# EasyEDA Pro project Car.eprj, board PCB1
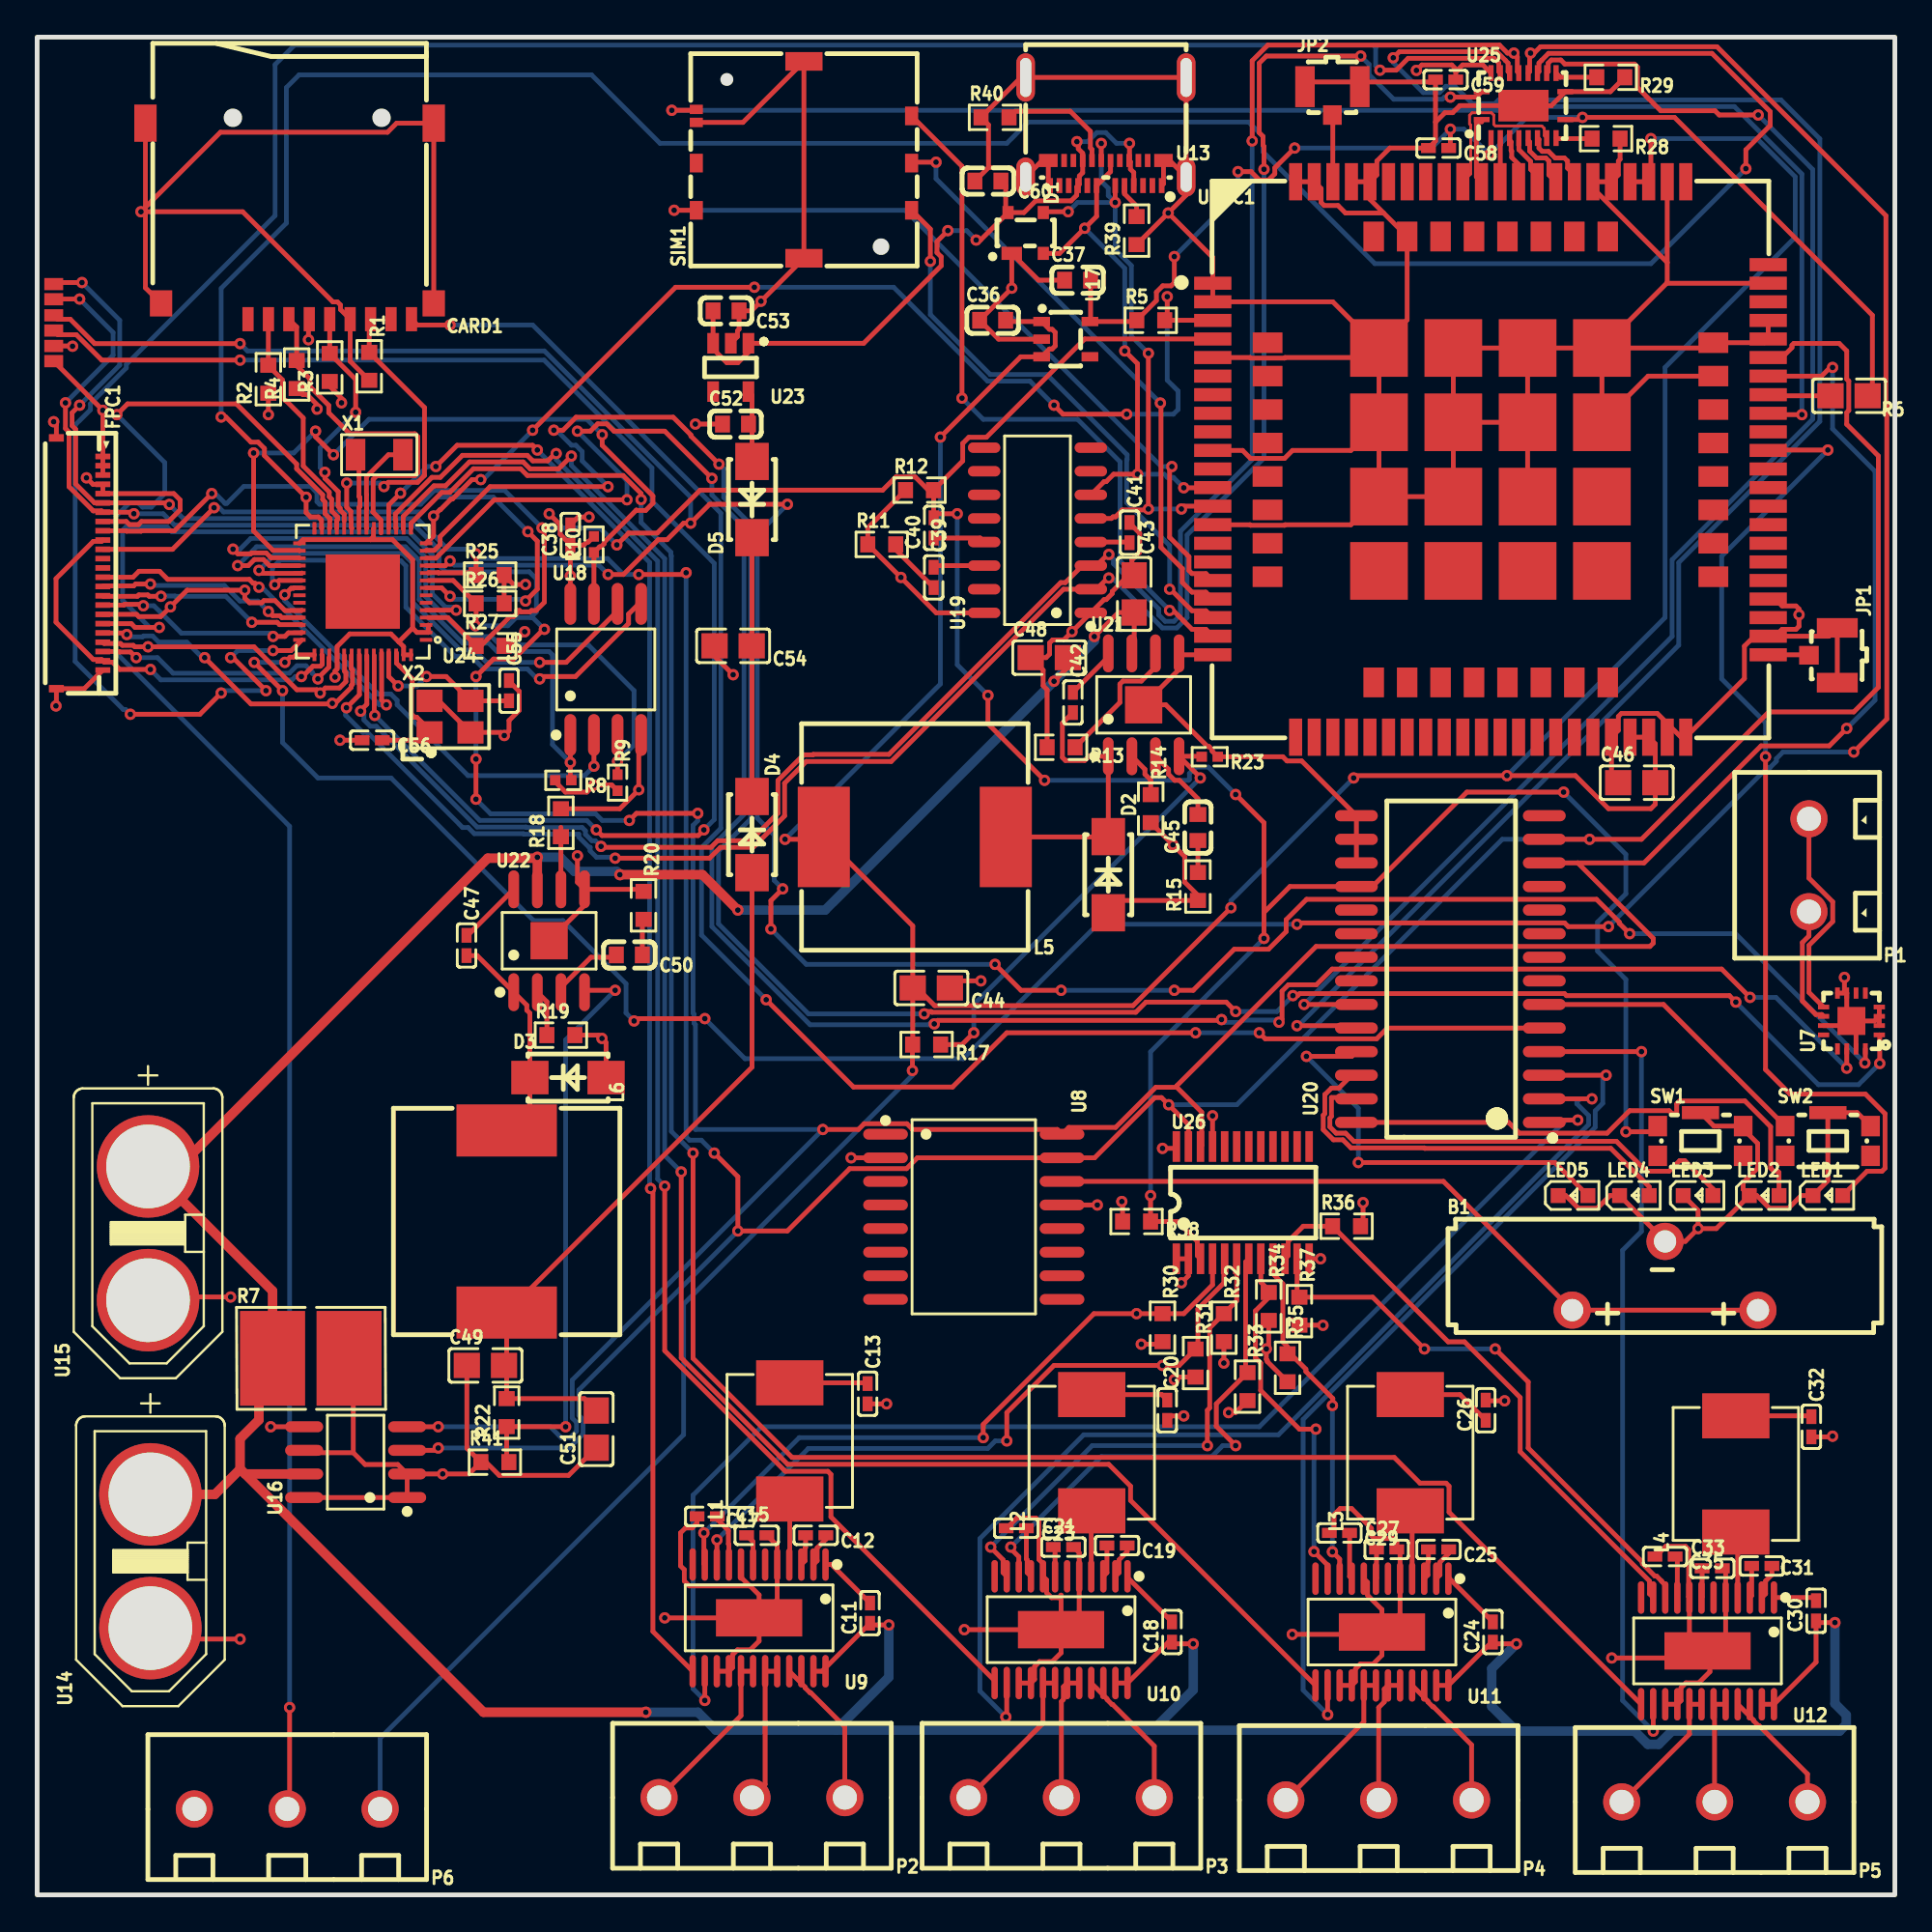
[diagram p2: board, top side]
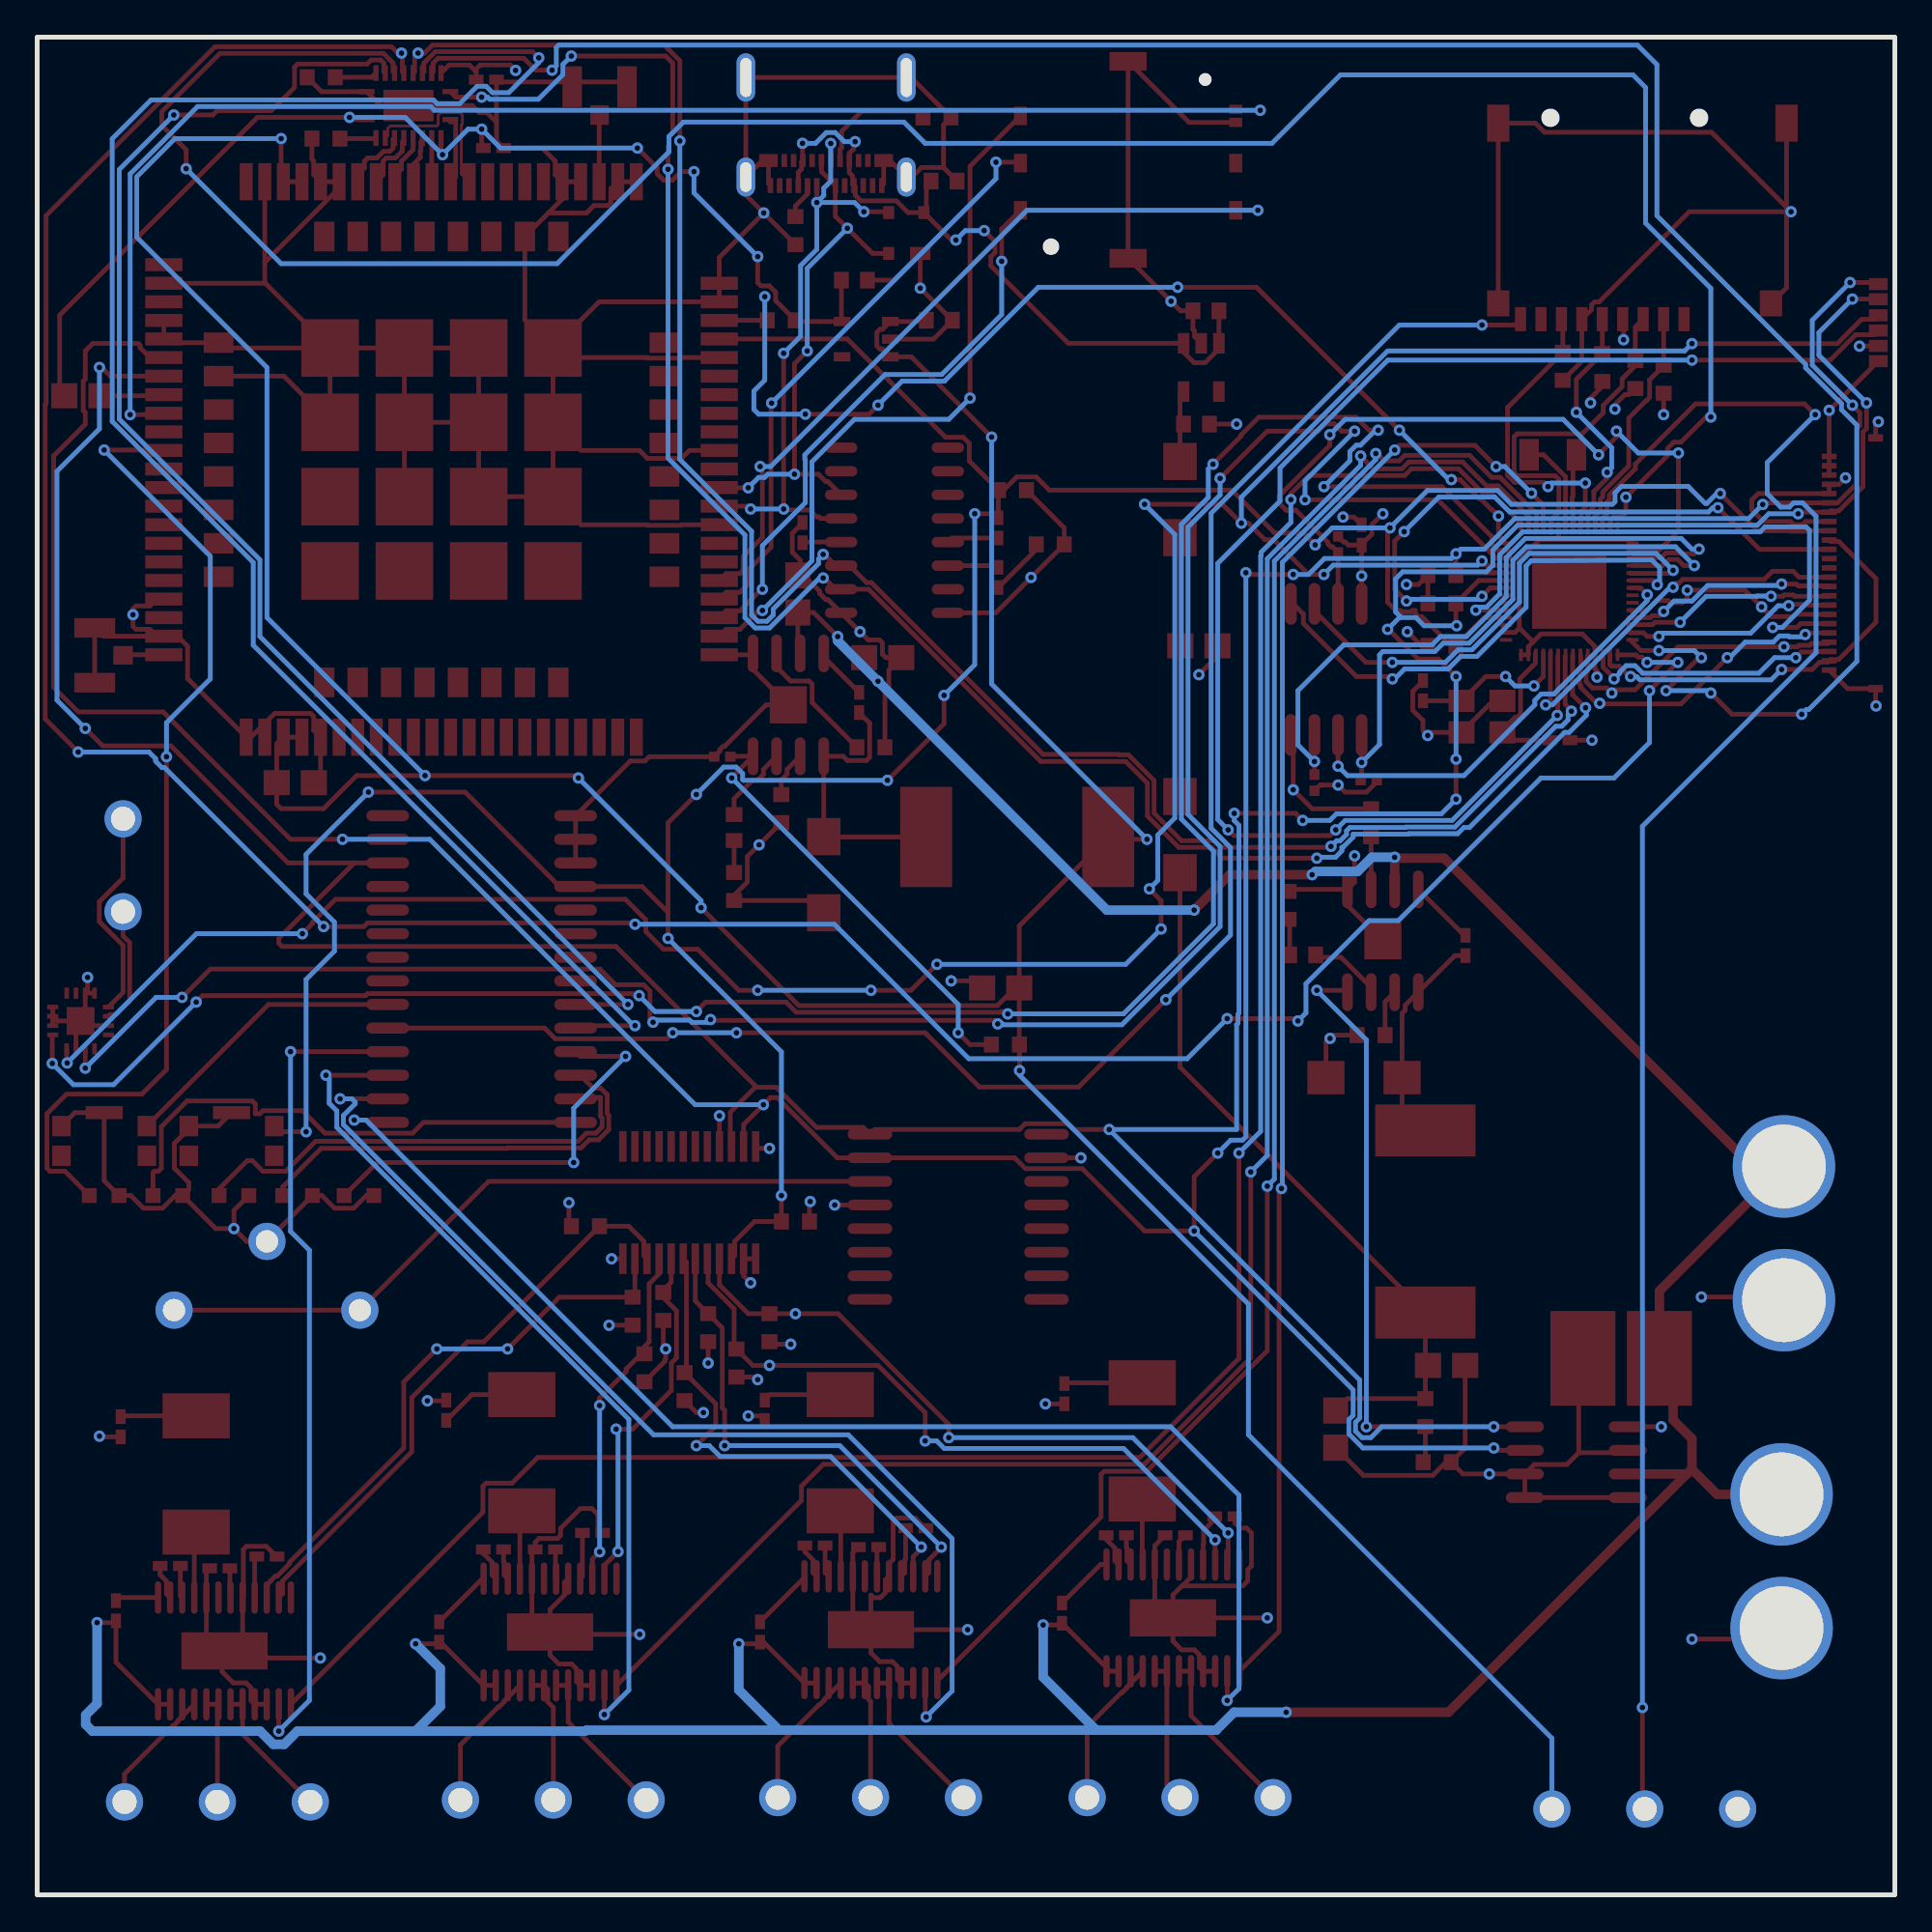
[diagram p3: board, bottom side, seen from below]

Outline 100 x 100 mm; copper layers: Top Layer, Inner1, Inner2, Bottom Layer. Coordinates in mm from the lower left corner of the outline.
Outline path: rectangle 0,100 100,0
Stack: Top Layer 0.035mm Outer layer thickness 1oz / Dielectric1 0.2104mm 7628 RC49% 8.6mil / Inner1 0.0152mm Inner layer thickness / Dielectric2 1.065mm 1.1mm H/HOZ Copper / Inner2 0.0152mm Inner layer thickness / Dielectric3 0.2104mm 7628 RC49% 8.6mil / Bottom Layer 0.035mm Outer layer thickness 1oz

## Design rules (mm)
template: Custom Config
spacing copperThickness1oz (default): track to track 0.102, other pairs 0.152 to 0.3
spacing copperThickness2oz: track to track 0.203, other pairs 0.152 to 0.3
track width copperThickness1oz (default): min 0.127, default 0.254, max 2.54
track width copperThickness2oz: min 0.203, default 0.254, max 2.54
differential pair differentialPair (default): width min 0.127, default 0.254, max 2.54; gap min 0.152, default 0.152
via viaSize (default): diameter min 0.5, default 0.61, max 10; hole min 0.3, default 0.305, max 6.3

## Placement (name value [footprint] x y rotation side)
B1  CR2032-BS-5-1  [BAT-TH_CR2032-BS-5-1]  87.63 33.33 0 top
C11  100nF  [C0402]  44.83 15.16 90 top
C12  100nF  [C0402]  41.91 19.35 180 top
C13  100nF  [C0402]  44.7 26.97 270 top
C15  100nF  [C0402]  38.74 19.35 0 top
C17  100nF  [C0402]  36.07 20.37 180 top
C18  100nF  [C0402]  61.09 14.15 90 top
C19  100nF  [C0402]  58.13 18.8 180 top
C20  100nF  [C0402]  60.83 26.09 270 top
C21  100nF  [C0402]  55.25 18.72 0 top
C23  100nF  [C0402]  52.71 19.74 180 top
C24  100nF  [C0402]  78.36 14.15 90 top
C25  100nF  [C0402]  75.44 18.59 180 top
C26  100nF  [C0402]  77.98 26.09 90 top
C27  100nF  [C0402]  72.64 18.59 0 top
C29  100nF  [C0402]  70.1 19.48 180 top
C30  100nF  [C0402]  95.76 15.29 90 top
C31  100nF  [C0402]  92.84 17.7 180 top
C32  100nF  [C0402]  95.5 25.2 270 top
C33  100nF  [C0402]  90.17 17.58 0 top
C35  100nF  [C0402]  87.63 18.21 180 top
C36  1uF  [C0603]  51.44 84.76 0 top
C37  1uF  [C0603]  56.01 86.92 0 top
C38  100nF  [C0402]  28.7 73.2 90 top
C39  100nF  [C0402]  48.26 70.92 270 top
C40  100nF  [C0402]  48.26 73.58 90 top
C41  4.7uF  [C0402]  58.8 73.33 270 top
C42  100nF  [C0402]  55.75 64.19 270 top
C43  10uF  [C0805]  59.06 70.03 270 top
C44  22uF  [C0805]  48.13 48.82 180 top
C45  220pF  [C0603]  62.48 57.45 90 top
C46  22uF  [C0805]  86.11 59.87 0 top
C47  100nF  [C0402]  23.11 51.11 270 top
C48  10uF  [C0805]  54.48 66.6 0 top
C49  22uF  [C0805]  24.13 28.5 0 top
C50  220pF  [C0603]  31.88 50.6 180 top
C51  22uF  [C0805]  30.1 25.07 90 top
C52  1uF  [C0603]  37.59 79.17 0 top
C53  1uF  [C0603]  37.08 85.27 180 top
C54  22uF  [C0805]  37.47 67.23 180 top
C55  20pF  [C0402]  25.4 64.82 270 top
C56  20pF  [C0402]  18.03 62.15 180 top
C58  100nF  [C0402]  75.44 94.03 180 top
C59  100nF  [C0402]  75.82 97.71 180 top
C60  1uF  [C0603]  51.18 92.25 180 top
CARD1  TF-01A  [TF-SMD_TF-01A]  13.59 90.09 180 top
D1  TPD2E001DZDR  [SOT-143_L2.9-W1.3-P1.92-LS2.3-BR]  53.21 89.46 270 top
D2  SS32  [SMAF_L4.3-W2.5-LS5.0-RD]  57.66 54.92 270 top
D3  SS32  [SMAF_L4.3-W2.5-LS5.0-RD]  28.57 43.99 0 top
D4  SS32  [SMAF_L4.3-W2.5-LS5.0-RD]  38.48 57.07 270 top
D5  SS32  [SMAF_L4.3-W2.5-LS5.0-RD]  38.48 75.11 90 top
FPC1  FFC2B28-24-G  [FPC-SMD_24P-P0.50_XKB_X05A10L24G]  2.29 71.68 270 top
JP1  U.FL-R-SMT-1(80)  [RF-SMD_FRF05002-JSS103M]  96.14 66.73 270 top
JP2  U.FL-R-SMT-1(80)  [RF-SMD_FRF05002-JSS103M]  69.72 96.57 0 top
L1  47uH  [IND-SMD_L7.0-W6.6_FXL0630]  40.51 24.44 90 top
L2  47uH  [IND-SMD_L7.0-W6.6_FXL0630]  56.77 23.8 90 top
L3  47uH  [IND-SMD_L7.0-W6.6_FXL0630]  73.91 23.8 90 top
L4  47uH  [IND-SMD_L7.0-W6.6_FXL0630]  91.44 22.66 90 top
L5  10uH  [IND-SMD_L12.0-W12.0]  47.24 56.95 180 top
L6  10uH  [IND-SMD_L12.0-W12.0]  25.27 36.25 270 top
LED1  KT-0603R  [LED0603-RD]  96.39 37.64 0 top
LED2  KT-0603R  [LED0603-RD]  92.96 37.64 0 top
LED3  KT-0603R  [LED0603-RD]  89.41 37.64 0 top
LED4  KT-0603R  [LED0603-RD]  85.98 37.64 0 top
LED5  KT-0603R  [LED0603-RD]  82.68 37.64 0 top
NOREF  -  [Pad_e325]  0.89 86.71 0 top
NOREF#2  -  [Pad_e336]  0.89 82.56 0 top
NOREF#3  -  [Pad_e333]  0.89 85.03 0 top
NOREF#4  -  [Pad_e334]  0.89 84.21 0 top
NOREF#5  -  [Pad_e327]  0.89 85.89 0 top
NOREF#6  -  [Pad_e335]  0.89 83.38 0 top
P1  WJ126V-5.0-2P  [CONN-TH_WJ126V-5.0-2P]  95.38 55.42 180 top
P2  WJ126V-5.0-3P  [CONN-TH_3P-P5.00_WJ126V-5.0-3P]  38.48 5.23 180 top
P3  WJ126V-5.0-3P  [CONN-TH_3P-P5.00_WJ126V-5.0-3P]  55.14 5.23 180 top
P4  WJ126V-5.0-3P  [CONN-TH_3P-P5.00_WJ126V-5.0-3P]  72.22 5.11 180 top
P5  WJ126V-5.0-3P  [CONN-TH_3P-P5.00_WJ126V-5.0-3P]  90.3 5 180 top
P6  WJ126V-5.0-3P  [CONN-TH_3P-P5.00_WJ126V-5.0-3P]  13.46 4.62 180 top
R1  10kΩ  [R0603]  17.87 82.28 270 top
R2  10kΩ  [R0603]  12.45 81.58 90 top
R3  10kΩ  [R0603]  15.75 82.22 90 top
R4  10kΩ  [R0603]  13.97 81.84 90 top
R5  1kΩ  [R0603]  59.94 84.76 0 top
R6  3.7kΩ  [C0805]  97.54 80.7 180 top
R7  5mΩ  [R2818]  14.73 28.88 0 top
R8  100kΩ  [R0402]  28.32 60 180 top
R9  100kΩ  [R0402]  31.24 59.87 270 top
R10  100kΩ  [R0402]  29.97 72.69 90 top
R11  10kΩ  [R0603]  45.47 72.69 0 top
R12  10kΩ  [R0603]  47.5 75.62 0 top
R13  180kΩ  [R0603]  55.12 61.77 180 top
R14  1kΩ  [R0603]  59.94 58.47 270 top
R15  68.1kΩ  [R0603]  62.48 54.28 90 top
R17  127kΩ  [R0603]  47.88 45.77 180 top
R18  180kΩ  [R0603]  28.19 57.71 90 top
R19  1kΩ  [R0603]  28.19 46.28 0 top
R20  68.1kΩ  [R0603]  32.64 53.26 270 top
R22  127kΩ  [R0603]  25.27 25.96 90 top
R23  31.6kΩ  [R0402]  63.12 61.27 180 top
R25  10kΩ  [R0603]  24.38 71.04 0 top
R26  10kΩ  [R0603]  24.38 69.52 0 top
R27  10kΩ  [R0603]  24.38 67.23 0 top
R28  47kΩ  [R0603]  84.46 94.54 180 top
R29  47kΩ  [R0603]  84.71 97.84 180 top
R30  10kΩ  [R0603]  60.58 30.53 270 top
R31  10kΩ  [R0603]  62.36 28.63 270 top
R32  10kΩ  [R0603]  63.88 30.53 270 top
R33  10kΩ  [R0603]  65.15 27.36 270 top
R34  10kΩ  [R0603]  66.29 31.67 270 top
R35  10kΩ  [R0603]  67.31 28.37 270 top
R36  10kΩ  [R0603]  70.49 35.99 0 top
R37  10kΩ  [R0603]  67.94 31.42 270 top
R38  10kΩ  [R0603]  59.18 36.25 180 top
R39  5.1kΩ  [R0603]  59.18 89.59 90 top
R40  5.1kΩ  [R0603]  51.56 95.68 0 top
R41  40.2kΩ  [R0603]  24.64 23.29 0 top
SIM1  SIM8055-6-1-14-01-A  [SIM-SMD_SIM8055-6-1-14-01-A]  41.28 93.4 90 top
SW1  KMR221GLFS  [KEY-SMD_KMR2XXGXXX]  89.53 40.94 0 top
SW2  KMR221GLFS  [KEY-SMD_KMR2XXGXXX]  96.39 40.94 0 top
U7  MAX98357AETE+T  [TQFN-16_L3.0-W3.0-P0.50-BL-EP1.5]  97.66 47.04 90 top
U8  DS3231SN#T&R  [SOIC-16_L10.3-W7.5-P1.27-LS10.3-BL]  50.42 36.5 270 top
U9  DRV10983PWPR  [HTSSOP-24_L7.8-W4.4-P0.65-LS6.4-BL-EP-1]  38.86 14.91 180 top
U10  DRV10983PWPR  [HTSSOP-24_L7.8-W4.4-P0.65-LS6.4-BL-EP-1]  55.12 14.28 180 top
U11  DRV10983PWPR  [HTSSOP-24_L7.8-W4.4-P0.65-LS6.4-BL-EP-1]  72.39 14.15 180 top
U12  DRV10983PWPR  [HTSSOP-24_L7.8-W4.4-P0.65-LS6.4-BL-EP-1]  89.92 13.13 180 top
U13  SIM7600G  [COMM-SMD_135P-L30.0-W30.0_SIM7600G]  78.23 77.27 0 top
U14  XT60-F  [CONN-TH_XT60PB-F]  6.1 17.96 90 top
U15  XT60-F  [CONN-TH_XT60PB-F]  5.97 35.61 90 top
U16  INA219AID  [SOIC-8_L4.9-W3.9-P1.27-LS6.0-BL]  17.14 23.29 90 top
U17  AP2112K-1.8TRG1  [SOT-25_L3.0-W1.6-P0.95-LS2.8-BL]  55.37 83.74 270 top
U18  W25Q128JVSIQ  [SOIC-8_L5.3-W5.3-P1.27-LS8.0-BL]  30.61 65.96 0 top
U19  CH340C  [SOP-16_L10.0-W3.9-P1.27-LS6.0-BL]  53.85 73.46 90 top
U20  MCP23017-E/SO  [SOIC-28_L18.0-W7.5-P1.27-LS10.3-BL]  76.07 49.83 90 top
U21  MP1584EN-LF-Z  [SOIC-8_L5.0-W4.0-P1.27-LS6.0-BL-EP2.0]  59.56 64.06 0 top
U22  MP1584EN-LF-Z  [SOIC-8_L5.0-W4.0-P1.27-LS6.0-BL-EP2.0]  27.56 51.36 0 top
U23  AP2112K-3.3TRG1  [SOT-25-5_L2.9-W1.6-P0.95-LS2.8-BL]  37.34 82.22 180 top
U24  ESP32-S3  [QFN-56_L7.0-W7.0-P0.40-TL-EP4.0]  17.53 70.16 180 top
U25  TXB0108RGYR  [VQFN-20_L4.5-W3.5-P0.50-BL-EP]  80.01 96.32 0 top
U26  TCA9548APWR  [TSSOP-24_L7.8-W4.4-P0.65-LS6.4-BL]  64.9 37.26 0 top
USBC1  1054500101  [USB-C-SMD_TYPE-C-USB-18]  57.53 94.92 180 top
X1  32.768kHz  [OSC-SMD_L3.2-W1.5]  18.42 77.52 0 top
X2  40MHz  [OSC-SMD_4P-L3.2-W2.5-BL_SIT8008BI]  22.22 63.42 0 top

## Footprints (pads in the part's own frame, mm; a bottom-side part is the same pattern mirrored in y, then rotated)
BAT-TH_CR2032-BS-5-1
  round 2 hole 1.2: 1(-5,-1.85) 1(5,-1.85) 2(0,1.85)
C0402
  rect 0.79x0.54 smd: 1(-0.545,0) 2(0.545,0)
C0603
  rect 0.8x0.9 smd: 1(-0.7,0) 2(0.7,0)
C0805
  rect 1.41x1.35 smd: 1(-1,0) 2(1,0)
COMM-SMD_135P-L30.0-W30.0_SIM7600G
  rect 2x0.7 smd: 1(-14.95,9.486) 2(-14.95,8.486) 3(-14.95,7.486) 4(-14.95,6.486) 5(-14.95,5.486) 6(-14.95,4.486) 7(-14.95,3.486) 8(-14.95,2.486) 9(-14.95,1.486) 10(-14.95,0.486) 11(-14.95,-0.514) 12(-14.95,-1.514) 13(-14.95,-2.514) 14(-14.95,-3.514) 15(-14.95,-4.514) 16(-14.95,-5.514) 17(-14.95,-6.514) 18(-14.95,-7.514) 19(-14.95,-8.514) 20(-14.95,-9.514) 41(14.95,-9.514) 42(14.95,-8.514) 43(14.95,-7.514) 44(14.95,-6.514) 45(14.95,-5.514) 46(14.95,-4.514) 47(14.95,-3.514) 48(14.95,-2.514) 49(14.95,-1.514) 50(14.95,-0.514) 51(14.95,0.486) 52(14.95,1.486) 53(14.95,2.486) 54(14.95,3.486) 55(14.95,4.486) 56(14.95,5.486) 57(14.95,6.486) 58(14.95,7.486) 59(14.95,8.486) 60(14.95,9.486) 81(-14.95,-10.514) 82(14.95,-10.514) 85(14.95,10.486)
  rect 0.7x2 smd: 21(-9.486,-14.95) 22(-8.486,-14.95) 23(-7.486,-14.95) 24(-6.486,-14.95) 25(-5.486,-14.95) 26(-4.486,-14.95) 27(-3.486,-14.95) 28(-2.486,-14.95) 29(-1.486,-14.95) 30(-0.486,-14.95) 31(0.514,-14.95) 32(1.514,-14.95) 33(2.514,-14.95) 34(3.514,-14.95) 35(4.514,-14.95) 36(5.514,-14.95) 37(6.514,-14.95) 38(7.514,-14.95) 39(8.514,-14.95) 40(9.514,-14.95) 61(9.514,14.95) 62(8.514,14.95) 63(7.514,14.95) 64(6.514,14.95) 65(5.514,14.95) 66(4.514,14.95) 67(3.514,14.95) 68(2.514,14.95) 69(1.514,14.95) 70(0.514,14.95) 71(-0.486,14.95) 72(-1.486,14.95) 73(-2.486,14.95) 74(-3.486,14.95) 75(-4.486,14.95) 76(-5.486,14.95) 77(-6.486,14.95) 78(-7.486,14.95) 79(-8.486,14.95) 80(-9.486,14.95) 83(10.514,-14.95) 84(-10.486,-14.95) 86(-10.486,14.95) 87(10.514,14.95)
  rect 1.6x1.1 smd: 88(-12,6.286) 89(-12,4.486) 90(-12,2.686) 91(-12,0.886) 92(-12,-0.914) 93(-12,-2.714) 94(-12,-4.514) 95(-12,-6.314) 104(12,-6.314) 105(12,-4.514) 106(12,-2.714) 107(12,-0.914) 108(12,0.886) 109(12,2.686) 110(12,4.486) 111(12,6.286)
  rect 1.1x1.6 smd: 96(-6.286,-12) 97(-4.486,-12) 98(-2.686,-12) 99(-0.886,-12) 100(0.914,-12) 101(2.714,-12) 102(4.514,-12) 103(6.314,-12) 112(6.314,12) 113(4.514,12) 114(2.714,12) 115(0.914,12) 116(-0.886,12) 117(-2.686,12) 118(-4.486,12) 119(-6.286,12)
  rect 3.1x3.1 smd: 120(-6,6) 121(-6,2) 122(-6,-2) 123(-6,-6) 124(-2,-6) 125(2,-6) 126(6,-6) 127(6,-2) 128(6,2) 129(6,6) 130(2,6) 131(-2,6) 132(-2,2) 133(-2,-2) 134(2,-2) 135(2,2)
CONN-TH_3P-P5.00_WJ126V-5.0-3P
  round 2 hole 1.3: 1(5,0) 2(-0.002,0) 3(-5,0)
CONN-TH_WJ126V-5.0-2P
  round 2 hole 1.3: 1(0,2.501) 2(0,-2.501)
CONN-TH_XT60PB-F
  round 5.516 hole 4.505x4.5: +(3.6,0) -(-3.6,0)
FPC-SMD_24P-P0.50_XKB_X05A10L24G
  rect 0.3x0.8 smd: 1(-5.75,1.25) 2(-5.25,1.25) 3(-4.75,1.25) 4(-4.25,1.25) 5(-3.75,1.25) 6(-3.25,1.25) 7(-2.75,1.25) 8(-2.25,1.25) 9(-1.75,1.25) 10(-1.25,1.25) 11(-0.75,1.25) 12(-0.25,1.25) 13(0.25,1.25) 14(0.75,1.25) 15(1.25,1.25) 16(1.75,1.25) 17(2.25,1.25) 18(2.75,1.25) 19(3.25,1.25) 20(3.75,1.25) 21(4.25,1.25) 22(4.75,1.25) 23(5.25,1.25) 24(5.75,1.25)
  rect 0.4x0.8 smd: 25(6.75,-1.25) 26(-6.75,-1.25)
HTSSOP-24_L7.8-W4.4-P0.65-LS6.4-BL-EP-1
  oval 0.343x1.746 smd: 1(-3.575,-2.873) 2(-2.925,-2.873) 3(-2.275,-2.873) 4(-1.625,-2.873) 5(-0.975,-2.873) 6(-0.325,-2.873) 7(0.325,-2.873) 8(0.975,-2.873) 9(1.625,-2.873) 10(2.275,-2.873) 11(2.925,-2.873) 12(3.575,-2.873) 13(3.575,2.873) 14(2.925,2.873) 15(2.275,2.873) 16(1.625,2.873) 17(0.975,2.873) 18(0.325,2.873) 19(-0.325,2.873) 20(-0.975,2.873) 21(-1.625,2.873) 22(-2.275,2.873) 23(-2.925,2.873) 24(-3.575,2.873)
  rect 4.64x2.005 smd: 25(0,0)
IND-SMD_L7.0-W6.6_FXL0630
  rect 2.424x3.62 smd: 1(3.128,0) 2(-3.128,0)
IND-SMD_L12.0-W12.0
  rect 2.8x5.4 smd: 1(4.9,0) 2(-4.9,0)
KEY-SMD_KMR2XXGXXX
  rect 1x1.1 smd: 1(-2.3,0.438) 2(2.3,0.438) 3(-2.3,-1.162) 4(2.3,-1.162)
  rect 2x0.7 smd: 5(0,1.162)
LED0603-RD
  rect 0.8x0.8 smd: 1(-0.799,0) 2(0.799,0)
OSC-SMD_4P-L3.2-W2.5-BL_SIT8008BI
  rect 1.4x1.2 smd: 1(-1.1,-0.85) 2(1.1,-0.85) 3(1.1,0.85) 4(-1.1,0.85)
OSC-SMD_L3.2-W1.5
  rect 1.05x1.7 smd: 1(-1.275,0) 2(1.275,0)
Pad_e325
  custom 1.016x0.651 smd: 1(0,0)
Pad_e327
  custom 1.016x0.651 smd: 1(0,0)
Pad_e333
  custom 1.016x0.651 smd: 1(0,0)
Pad_e334
  custom 1.016x0.651 smd: 1(0,0)
Pad_e335
  custom 1.016x0.651 smd: 1(0,0)
Pad_e336
  custom 1.016x0.651 smd: 1(0,0)
QFN-56_L7.0-W7.0-P0.40-TL-EP4.0
  rect 0.665x0.2 smd: 1(-3.408,2.6) 2(-3.408,2.2) 3(-3.408,1.8) 4(-3.408,1.4) 5(-3.408,1) 6(-3.408,0.6) 7(-3.408,0.2) 8(-3.408,-0.2) 9(-3.408,-0.6) 10(-3.408,-1) 11(-3.408,-1.4) 12(-3.408,-1.8) 13(-3.408,-2.2) 14(-3.408,-2.6) 29(3.408,-2.6) 30(3.408,-2.2) 31(3.408,-1.8) 32(3.408,-1.4) 33(3.408,-1) 34(3.408,-0.6) 35(3.408,-0.2) 36(3.408,0.2) 37(3.408,0.6) 38(3.408,1) 39(3.408,1.4) 40(3.408,1.8) 41(3.408,2.2) 42(3.408,2.6)
  rect 0.2x0.665 smd: 15(-2.6,-3.408) 16(-2.2,-3.408) 17(-1.8,-3.408) 18(-1.4,-3.408) 19(-1,-3.408) 20(-0.6,-3.408) 21(-0.2,-3.408) 22(0.2,-3.408) 23(0.6,-3.408) 24(1,-3.408) 25(1.4,-3.408) 26(1.8,-3.408) 27(2.2,-3.408) 28(2.6,-3.408) 43(2.6,3.408) 44(2.2,3.408) 45(1.8,3.408) 46(1.4,3.408) 47(1,3.408) 48(0.6,3.408) 49(0.2,3.408) 50(-0.2,3.408) 51(-0.6,3.408) 52(-1,3.408) 53(-1.4,3.408) 54(-1.8,3.408) 55(-2.2,3.408) 56(-2.6,3.408)
  rect 4x4 smd: 57(0,0)
R0402
  rect 0.566x0.54 smd: 1(-0.433,0) 2(0.433,0)
R0603
  rect 0.806x0.864 smd: 1(-0.753,0) 2(0.753,0)
R2818
  rect 3.5x5.1 smd: 1(-2.06,0) 2(2.06,0)
RF-SMD_FRF05002-JSS103M
  rect 1x1.05 smd: 1(0,-0.762)
  rect 1.05x2.2 smd: 2(-1.475,0.762) 3(1.475,0.762)
SIM-SMD_SIM8055-6-1-14-01-A
  rect 0.5x0.7 smd: 1(2.715,5.795) C5(2.015,5.795)
  rect 1x2 smd: 2(5.3,0) 3(-5.3,0)
  rect 1x0.7 smd: C1(2.365,-5.795) C2(-0.175,-5.795) C3(-2.715,-5.795) C6(-0.175,5.795) C7(-2.715,5.795)
SMAF_L4.3-W2.5-LS5.0-RD
  rect 2x1.8 smd: 1(-2.05,0) 2(2.05,0)
SOIC-8_L4.9-W3.9-P1.27-LS6.0-BL
  oval 0.588x2.045 smd: 1(-1.905,-2.772) 2(-0.635,-2.772) 3(0.635,-2.772) 4(1.905,-2.772) 5(1.905,2.772) 6(0.635,2.772) 7(-0.635,2.772) 8(-1.905,2.772)
SOIC-8_L5.0-W4.0-P1.27-LS6.0-BL-EP2.0
  oval 0.574x2.038 smd: 1(-1.905,-2.769) 2(-0.635,-2.769) 3(0.635,-2.769) 4(1.905,-2.769) 5(1.905,2.769) 6(0.635,2.769) 7(-0.635,2.769) 8(-1.905,2.769)
  rect 2x2 smd: 9(0,0)
SOIC-8_L5.3-W5.3-P1.27-LS8.0-BL
  oval 0.63x2.25 smd: 1(-1.905,-3.53) 2(-0.635,-3.53) 3(0.635,-3.53) 4(1.905,-3.53) 5(1.905,3.53) 6(0.635,3.53) 7(-0.635,3.53) 8(-1.905,3.53)
SOIC-16_L10.3-W7.5-P1.27-LS10.3-BL
  oval 0.574x2.401 smd: 1(-4.445,-4.75) 2(-3.175,-4.75) 3(-1.905,-4.75) 4(-0.635,-4.75) 5(0.635,-4.75) 6(1.905,-4.75) 7(3.175,-4.75) 8(4.445,-4.75) 9(4.445,4.75) 10(3.175,4.75) 11(1.905,4.75) 12(0.635,4.75) 13(-0.635,4.75) 14(-1.905,4.75) 15(-3.175,4.75) 16(-4.445,4.75)
SOIC-28_L18.0-W7.5-P1.27-LS10.3-BL
  oval 0.6x2.3 smd: 1(-8.255,-5.058) 2(-6.985,-5.058) 3(-5.715,-5.058) 4(-4.445,-5.058) 5(-3.175,-5.058) 6(-1.905,-5.058) 7(-0.635,-5.058) 8(0.635,-5.058) 9(1.905,-5.058) 10(3.175,-5.058) 11(4.445,-5.058) 12(5.715,-5.058) 13(6.985,-5.058) 14(8.255,-5.058) 15(8.255,5.058) 16(6.985,5.058) 17(5.715,5.058) 18(4.445,5.058) 19(3.175,5.058) 20(1.905,5.058) 21(0.635,5.058) 22(-0.635,5.058) 23(-1.905,5.058) 24(-3.175,5.058) 25(-4.445,5.058) 26(-5.715,5.058) 27(-6.985,5.058) 28(-8.255,5.058)
SOP-16_L10.0-W3.9-P1.27-LS6.0-BL
  oval 0.56x1.745 smd: 1(-4.445,-2.873) 2(-3.175,-2.873) 3(-1.905,-2.873) 4(-0.635,-2.873) 5(0.635,-2.873) 6(1.905,-2.873) 7(3.175,-2.873) 8(4.445,-2.873) 9(4.445,2.873) 10(3.175,2.873) 11(1.905,2.873) 12(0.635,2.873) 13(-0.635,2.873) 14(-1.905,2.873) 15(-3.175,2.873) 16(-4.445,2.873)
SOT-25-5_L2.9-W1.6-P0.95-LS2.8-BL
  rect 0.623x1.105 smd: 1(-0.95,-1.3) 2(-0.001,-1.3) 3(0.95,-1.3) 4(0.95,1.3) 5(-0.95,1.3)
SOT-25_L3.0-W1.6-P0.95-LS2.8-BL
  rect 0.5x0.9 smd: 1(-0.95,-1.3) 2(0,-1.3) 3(0.95,-1.3) 4(0.95,1.3) 5(-0.95,1.3)
SOT-143_L2.9-W1.3-P1.92-LS2.3-BR
  rect 0.7x1.1 smd: 1(1.1,-0.75)
  rect 0.7x0.6 smd: 2(1.1,0.95) 3(-1.1,0.95) 4(-1.1,-0.95)
TF-SMD_TF-01A
  rect 0.6x1.3 smd: 1(2.24,5.276) 2(1.14,5.276) 3(0.04,5.276) 4(-1.06,5.276) 5(-2.16,5.276) 6(-3.26,5.276) 7(-4.36,5.276) 8(-5.46,5.276) 9(-6.56,5.276)
  rect 1.2x1.4 smd: 10(-7.76,4.426) 13(6.92,4.426)
  rect 1.2x2 smd: 11(-7.76,-5.276) 12(7.76,-5.276)
TQFN-16_L3.0-W3.0-P0.50-BL-EP1.5
  rect 0.25x0.6 smd: 1(-0.749,-1.5) 2(-0.248,-1.5) 3(0.252,-1.5) 4(0.751,-1.5) 9(0.75,1.5) 10(0.25,1.5) 11(-0.25,1.5) 12(-0.749,1.5)
  rect 0.6x0.25 smd: 5(1.5,-0.748) 6(1.5,-0.248) 7(1.5,0.252) 8(1.5,0.752) 13(-1.5,0.752) 14(-1.5,0.252) 15(-1.5,-0.248) 16(-1.5,-0.748)
  rect 1.5x1.5 smd: 17(0,0)
TSSOP-24_L7.8-W4.4-P0.65-LS6.4-BL
  rect 0.4x1.65 smd: 1(-3.575,-3.022) 2(-2.925,-3.022) 3(-2.275,-3.022) 4(-1.625,-3.022) 5(-0.975,-3.022) 6(-0.325,-3.022) 7(0.325,-3.022) 8(0.975,-3.022) 9(1.625,-3.022) 10(2.275,-3.022) 11(2.925,-3.022) 12(3.575,-3.022) 13(3.575,3.022) 14(2.925,3.022) 15(2.275,3.022) 16(1.625,3.022) 17(0.975,3.022) 18(0.325,3.022) 19(-0.325,3.022) 20(-0.975,3.022) 21(-1.625,3.022) 22(-2.275,3.022) 23(-2.925,3.022) 24(-3.575,3.022)
USB-C-SMD_TYPE-C-USB-18
  oval 1x2.1 hole 0.6x1.6: 0(-4.32,2.45) 0(4.32,2.45)
  oval 1x2.6 hole 0.6x2.1: 0(-4.32,-2.91) 0(4.32,-2.91)
  rect 0.3x0.8 smd: A1(-3,2.91) A2(-2.5,2.91) A3(-2,2.91) A4(-1.5,2.91) A5(-1,2.91) A6(-0.5,2.91) A7(0.5,2.91) A8(1,2.91) A9(1.5,2.91) A10(2,2.91) A11(2.5,2.91) A12(3,2.91)
  rect 1x0.7 smd: B1(3.1,1.56) B12(-3.1,1.56)
  rect 0.3x0.7 smd: B2(2.25,1.56) B3(1.75,1.56) B4(1.25,1.56) B5(0.75,1.56) B6(0.25,1.56) B7(-0.25,1.56) B8(-0.75,1.56) B9(-1.25,1.56) B10(-1.75,1.56) B11(-2.25,1.56)
VQFN-20_L4.5-W3.5-P0.50-BL-EP
  rect 0.85x0.28 smd: 1(-2.25,-0.752) 10(2.25,-0.752) 11(2.25,0.748) 20(-2.25,0.75)
  rect 0.28x0.85 smd: 2(-1.748,-1.75) 3(-1.248,-1.75) 4(-0.749,-1.75) 5(-0.248,-1.75) 6(0.252,-1.75) 7(0.751,-1.75) 8(1.252,-1.75) 9(1.752,-1.75) 12(1.752,1.75) 13(1.252,1.75) 14(0.75,1.748) 15(0.25,1.748) 16(-0.25,1.748) 17(-0.75,1.748) 18(-1.25,1.748) 19(-1.75,1.748)
  rect 2.7x1.7 smd: 21(0,-0.002)

## Nets
As in the schematic, except:
+3V3: C38.1 C54.2 C59.1 CARD1.4 FPC1.1 FPC1.2 FPC1.3 NOREF#2.1 R8.2 R9.2 R10.2 R11.1 R12.1 R25.2 R26.2 R27.2 R30.2 R31.2 R32.2 R33.2 R34.2 R35.2 R36.2 R37.2 R38.2 U8.2 U16.5 U18.8 U19.16 U24.2 U24.3 U24.20 U24.29 U24.46 U24.55 U24.56 U25.19 U26.24
GND: B1.2 C13.2 C15.2 C17.2 C20.2 C21.2 C23.2 C26.2 C27.2 C29.2 C32.2 C33.2 C35.2 C36.1 C37.1 C38.2 C41.1 C43.1 C44.1 C46.1 C48.1 C49.1 C51.1 C52.1 C53.1 C55.1 C56.2 C58.2 C59.2 C60.2 CARD1.6 CARD1.10 CARD1.11 CARD1.12 CARD1.13 D1.1 D2.2 D3.2 FPC1.4 FPC1.5 FPC1.8 FPC1.24 FPC1.25 FPC1.26 JP1.2 JP1.3 JP2.2 JP2.3 LED1.1 LED2.1 LED3.1 LED4.1 LED5.1 NOREF#6.1 P6.1 R1.2 R2.1 R3.1 R4.1 R7.2 R13.2 R14.2 R15.1 R18.2 R19.2 R20.1 R23.1 R28.1 R29.1 R39.1 R40.1 R41.1 SIM1.2 SIM1.3 SIM1.C5 SW1.2 SW1.5 SW2.2 SW2.5 U7.2 U7.3 U7.4 U7.7 U7.8 U7.11 U7.15 U7.17 U8.13 U9.5 U9.8 U9.15 U9.16 U9.25 U10.5 U10.8 U10.15 U10.16 U10.25 U11.5 U11.8 U11.15 U11.16 U11.25 U12.5 U12.8 U12.15 U12.16 U12.25 U13.1 U13.2 U13.5 U13.10 U13.14 U13.37 U13.40 U13.41 U13.43 U13.57 U13.58 U13.60 U13.61 U13.64 U13.65 U13.77 U13.78 U13.80 U13.81 U13.83 U13.86 U13.110 U13.111 U13.118 U13.120 U13.121 U13.122 U13.128 U13.129 U13.130 U13.131 U13.132 U13.133 U13.134 U13.135 U14.- U15.- U16.1 U16.2 U16.6 U16.8 U17.2 U18.4 U19.1 U20.15 U20.16 U20.17 U21.5 U21.9 U22.5 U22.9 U23.2 U24.57 U25.11 U25.21 U26.1 U26.2 U26.12 U26.21 USBC1.0 USBC1.A1 USBC1.A12 USBC1.B1 USBC1.B12 X2.2 X2.4
BCLK: NOREF#3.1 U7.16 U24.11
DATA: NOREF#4.1 U24.51
SCL: FPC1.7 NOREF#5.1 R26.1 U8.16 U13.55 U16.4 U20.12 U24.9 U26.22
SDA: FPC1.6 NOREF.1 R25.1 U8.15 U13.56 U16.3 U20.13 U24.10 U26.23

Pads without a net: CARD1 1 8; FPC1 12 13; SIM1 C6; SW1 3 4; SW2 3 4; U7 5 6 12 13; U8 1 3 4 5 6 7 8 9 10 11 12; U9 6 12; U10 6 12; U11 6 12; U12 6 12; U13 6 7 8 9 11 15 16 21 22 23 24 25 26 27 28 29 30 31 32 33 34 35 36 42 44 45 46 47 48 49 50 52 59 73 74 75 76 84 85 87 88 89 90 91 92 93 94 95 96 97 98 99 100 101 102 103 104 105 106 107 108 109 112 113 114 115 116 117 119 123 124 125 126 127; U17 4; U19 7 8 9 10 11 12 15; U20 7 8 9 10 11 14 19 20 21 22; U23 4; U24 1 6 7 28 36 37; U26 13 14 15 16 17 18 19 20; USBC1 A2 A3 A8 A10 A11 B2 B3 B8 B10 B11

## Via types
v1: diameter 0.61, hole 0.305, Top Layer to Bottom Layer, 309 vias

## Routing (per net, layer and track width the routed paths; a pad name or vN(x,y) marks a point on that pad's centre or on a via; arc(x,y) is an arc through that point)
+1.8V: length 64.1
  Top Layer w0.254: v1(76.07,95.05) 76.07,94.12 75.98,94.03 ; v1(61.21,88.19) 61.21,86.78 61.04,86.61 60.59,86.61 60.25,86.27 60.25,85.82 R5.1 59.12,84.69 U17.5 56.71,84.73 C37.2 ; 78.26,94.57 78.26,93.76 v1(78.18,93.67) ; v1(67.69,94.03) 66.62,92.96 66.62,92.65 66.28,92.3 65.8,92.3 65.34,92.76 v1(64.64,92.76) ; 98.79,80.7 98.79,85.03 88.14,95.68 v1(83.19,95.68) 83.07,95.56 U25.10
  Bottom Layer w0.254: v1(64.64,92.76) 64.64,91.62 v1(61.21,88.19) ; v1(67.69,94.03) 75.06,94.03 v1(76.07,95.05) 76.8,95.05 v1(78.18,93.67) 80.19,95.68 v1(83.19,95.68)
+3V3: length 79
  Top Layer w0.254: 27.56,74.35 28.15,73.75 28.15,73.24 28.7,72.69 C38.1 ; R37.2 69.21,30.67 v1(69.22,30.66) ; v1(14.61,83.71) 14.61,84.77 CARD1.4 ; U25.19 77.82,98.5 76.74,98.5 76.44,98.21 ; v1(71.37,37.26) 71.37,36.13 R36.2 ; 19.47,67.45 19.73,67.19 U24.55 U24.56 ; 19.47,67.45 19.04,67.88 16.83,67.88 16.15,67.2 16.15,65.99 16.03,65.87 v1(16.03,65.55) ; 19.47,67.45 20.2,68.19 20.21,68.19 ; v1(64.13,25.96) 64.51,25.96 R33.2 ; R12.1 44.71,73.58 R11.1 48.4,69.01 U19.16 ; R26.2 R25.2 25.65,70.54 v1(26.29,70.54) ; v1(58.39,37.32) 58.43,37.28 R38.2 ; R34.2 66.29,29.51 v1(66.17,29.39) 66.17,28.83 66.22,28.78 66.22,28.71 R35.2 ; U16.5 v1(12.57,25.2) ; 27.89,60.12 27.89,59.91 28.44,59.36 29.59,59.36 v1(29.97,59.74) 30.85,59.74 30.86,59.74 30.94,59.74 31.24,59.44 ; C38.1 v1(28.7,70.99) U18.8 ; C38.1 29.42,72.66 29.59,72.82 29.67,72.82 R10.2 ; v1(59.44,29.64) 60.44,29.64 R30.2 ; 20.21,68.19 20.45,67.95 21.06,67.95 21.06,68.36 ; 20.21,68.19 20.21,71.86 19.13,72.95 17.94,72.95 17.94,72.95 ; 76.44,98.21 76.36,98.13 C59.1 ; 76.44,98.21 76.15,98.5 74.54,98.5 v1(74.25,98.21) ; U8.2 v1(43.81,39.67) ; FPC1.3 FPC1.2 FPC1.1 v1(3.54,79.91) NOREF#2.1 ; 17.94,72.95 14.31,72.95 U24.29 ; 17.94,72.95 18.11,73.11 18.11,73.54 U24.20 ; U26.24 61.22,40.18 v1(60.58,40.18) ; R27.2 25.48,67.23 v1(26.25,68) ; v1(61.21,27.74) 61.35,27.87 R31.2 ; C54.2 36.47,66.68 v1(37.47,65.68) ; v1(63.88,28.63) R32.2
  vias: v1(27.56,74.34) v1(46.5,70.92)
+4V: length 207.3
  Top Layer w0.254: C36.2 52.2,84.69 U17.1 54.49,84.27 54.64,84.27 54.8,84.11 54.8,83.38 54.64,83.22 54.49,83.22 U17.3 52.94,82.79 v1(48.62,78.47) ; C44.2 47.13,52.16 L5.1 42.22,56.82 v1(40.26,56.82) ; C44.2 47.36,48.82 48.31,47.86 58.99,47.86 v1(64.26,53.14) ; C44.2 47.13,45.78 R17.2 47.12,45.76 v1(47.12,44.37) ; v1(86.87,94.54) 86.87,92.34 U13.62 U13.63 ; U13.38 U13.39 87.11,61.96 C46.2 87.11,58.71 86.87,58.47 84.58,58.47 82.8,60.25 v1(79.12,60.25) 70.99,60.25 v1(70.87,60.12)
  Bottom Layer w0.254: v1(47.12,44.37) 47.12,44.12 34.8,31.8 34.8,24.77 18.46,8.43 P6.3 ; v1(79.12,60.25) 87.63,68.76 87.63,82.22 94.64,89.23 94.64,92.48 92.58,94.54 v1(86.87,94.54) ; v1(70.87,60.12) 64.26,53.52 v1(64.26,53.14) ; v1(48.62,78.47) 48.62,65.18 v1(40.26,56.82)
+5V: length 37.7
  Top Layer w0.254: USBC1.A4 59.03,92.72 58.85,92.89 58.85,93.29 USBC1.B9 58.8,93.38 v1(58.8,94.28) ; C60.1 52.14,92 52.14,90.94 ; C53.2 36.38,83.52 U23.3 36.39,83.21 37.13,82.47 37.72,82.47 38.29,83.04 U23.1 44.49,83.52 48.66,87.69 48.66,88.18 48.44,88.41 48.44,89 v1(49.02,89.59) ; v1(50.55,89.08) 50.78,89.08 D1.4 53.12,90.56 53.75,91.19 55.65,91.19 55.96,91.49 55.96,91.94 USBC1.A9 56.1,92.08 56.1,92.53 56.28,92.7 USBC1.B4 56.28,93.75 56.05,93.99 56.05,94.3 v1(55.97,94.38)
  Bottom Layer w0.254: v1(58.8,94.28) 58.1,94.28 57.52,94.86 57.04,94.86 56.55,94.38 v1(55.97,94.38) ; v1(50.55,89.08) 50.04,89.59 v1(49.02,89.59)
+11.1V: length 241.4
  Top Layer w0.254: v1(45.85,14.53) 44.92,14.53 C11.1 42.25,12.04 U9.23 ; U12.23 U12.24 95.76,12.53 C30.1 95.85,14.66 v1(96.77,14.66) ; C43.2 59.06,66.95 U21.7 ; 58.93,69.03 58.2,69.03 v1(56.91,67.73) ; C48.2 55.48,66.08 v1(54.74,65.33) ; v1(62.23,13.51) 61.18,13.51 C18.1 60.89,13.6 U10.24 U10.23 ; v1(79.63,13.51) 78.45,13.51 C24.1 78.29,13.6 U11.24 U11.23
  Top Layer w0.508: v1(32.77,9.83) 24.03,9.83 11.2,22.66 ; 11.2,22.66 10.92,22.93 ; 11.2,22.66 U16.7 ; U22.7 v1(26.92,55.85) 26.87,55.8 24.26,55.8 7.66,39.21 U15.+ 12.67,32.51 R7.1 11.94,28.15 11.94,25.57 10.92,24.55 10.92,22.93 ; 10.92,22.93 10.92,22.91 9.57,21.56 U14.+ ; v1(37.72,53.01) 35.81,54.92 v1(31.37,54.92)
  Bottom Layer w0.508: v1(79.63,13.51) 78.3,12.18 78.3,10.14 79.63,8.81 ; 60.06,8.87 70.43,8.87 70.49,8.81 79.63,8.81 ; 60.06,8.87 42.99,8.87 ; 60.06,8.87 62.23,11.03 v1(62.23,13.51) ; 42.99,8.87 36.54,8.87 35.57,9.83 v1(32.77,9.83) ; 42.99,8.87 45.85,11.72 v1(45.85,14.53) ; v1(26.92,55.85) 28.15,55.85 28.92,55.09 31.19,55.09 v1(31.37,54.92) ; 79.63,8.81 85.99,8.81 86.7,8.1 87.29,8.1 88,8.81 97.03,8.81 97.39,9.17 97.39,9.68 96.77,10.29 v1(96.77,14.66) ; v1(37.72,53.01) 42.42,53.01 v1(54.74,65.33) 56.91,67.5 v1(56.91,67.73)
GND: length 623.3
  Top Layer w0.254: 57.66,52.86 58.32,53.53 R15.1 62.48,53.8 61.77,54.51 61.77,55.89 v1(61.14,56.52) R14.2 ; v1(10.41,32.18) 6.14,32.18 U15.- ; U13.120 71.72,82.75 67.18,82.75 67.15,82.72 65.32,82.72 65.29,82.75 U13.5 ; U13.120 69.75,85.75 U13.2 U13.1 63.28,88.14 v1(60.89,90.54) ; U13.120 73.75,84.78 U13.118 72.48,90.53 ; U13.120 U13.121 ; v1(89.41,35.86) 90.39,35.86 LED2.1 ; v1(89.41,35.86) 89.41,36.84 LED3.1 ; v1(89.41,35.86) 88.72,35.17 B1.2 87.63,35.19 LED4.1 84.67,37.64 83.99,36.96 82.96,36.96 82.28,37.64 LED5.1 ; USBC1.A1 60.63,92.11 USBC1.B12 60.96,93.36 USBC1.0 ; 5.83,90.84 9.87,94.88 18.86,94.88 19.35,95.37 CARD1.11 CARD1.10 ; 5.83,90.84 5.83,90.6 ; 5.83,90.84 CARD1.12 ; LED2.1 91.84,37.97 91.84,38.34 92.61,39.12 92.61,40.45 91.84,41.23 SW1.2 90.26,41.38 SW1.5 ; LED2.1 92.57,37.64 93.25,36.96 94.28,36.96 94.96,37.64 LED1.1 96.39,38.44 SW2.5 97.97,42.11 SW2.2 ; USBC1.A12 54.43,92.11 USBC1.B1 54.1,93.36 USBC1.0 52.91,92.47 52.4,92.98 51.21,92.98 ; U22.5 29.46,53.26 U22.9 ; U22.5 29.08,54.51 v1(29.08,55.93) ; U22.5 32.53,54.13 R20.1 ; U23.2 37.7,83.88 37.7,84.19 37.78,84.27 C53.1 38.45,85.27 v1(38.96,85.78) SIM1.3 SIM1.2 37.99,95.41 SIM1.C5 ; U11.25 72.26,14.02 v1(67.56,14.02) ; U11.25 73.37,15.12 U11.5 73.37,18.42 C27.2 73.19,18.97 72.98,19.18 71.99,19.18 71.82,19.34 71.82,19.73 70.76,20.79 70.14,20.79 69.81,20.47 69.81,19.74 C29.2 ; U11.25 72.39,15.36 71.61,16.13 71.61,16.82 U11.8 ; U11.25 72.39,12.9 71.92,12.43 71.23,12.43 70.96,12.16 70.96,11.47 U11.16 70.12,11.28 ; U13.129 U13.130 ; U13.129 87.72,86.75 ; U13.129 U13.128 86.72,81.75 U13.110 ; U13.129 89.95,83.27 U13.111 92.98,83.55 U13.57 U13.58 ; U13.130 U13.135 ; U13.130 U13.131 U13.132 ; v1(60.89,90.54) 61.85,91.5 USBC1.0 ; v1(60.89,90.54) R39.1 ; 90.72,17.58 90.89,17.4 U12.5 90.89,13.85 90.04,13 90.04,12.01 89.44,11.41 88.75,11.41 88.49,11.15 88.49,10.46 U12.16 U12.15 ; R41.1 23.25,22.66 v1(21.83,22.66) U16.2 ; R41.1 24.16,23.29 24.87,22.58 28.61,22.58 C51.1 ; R41.1 23.13,24.05 C49.1 ; FPC1.24 2.54,64.93 FPC1.25 1.04,64.02 v1(1.01,64) ; v1(63.27,41.94) U26.21 ; U16.2 19.41,23.16 17.65,23.16 17.02,23.8 ; U16.2 U16.1 U16.8 ; U7.7 97.41,47.29 U7.17 ; U7.7 97.29,48.67 v1(97.29,49.39) ; U7.7 U7.8 ; R1.2 16.85,82.55 CARD1.6 16.33,85.34 16.33,85.58 16.16,85.75 15.92,85.75 11.06,90.6 5.83,90.6 ; 68.25,97.59 75.15,97.59 C59.2 75.27,95.43 ; USBC1.0 USBC1.0 USBC1.0 52.96,97.83 R40.1 51.21,95.28 51.21,92.98 ; v1(29.71,74.17) 29.12,74.17 C38.2 ; v1(78.99,26.59) 78.01,26.59 C26.2 ; U13.122 U13.133 U13.132 ; U13.122 70.72,73.75 67.18,73.75 67.15,73.72 65.32,73.72 65.29,73.75 U13.14 ; U13.122 U13.121 ; v1(61.59,32.94) 61.97,33.32 U26.2 U26.1 ; v1(57.07,37.14) U8.13 ; D3.2 30.62,45.88 30.23,46.28 R19.2 ; 72.48,90.53 70.43,90.53 70.03,90.94 69.28,90.94 69.12,91.1 69.12,91.85 U13.80 U13.86 ; 72.48,90.53 71.75,91.27 U13.77 ; U13.81 61.54,66.75 U21.5 61.47,65.96 U21.9 60.76,64.06 63,61.81 63.08,61.81 63.25,61.65 63.25,61.57 R23.1 67.05,61.27 67.28,61.04 68.07,61.04 U20.15 U20.16 U20.17 ; U7.15 97.91,46.79 U7.17 ; v1(2.66,76.28) 3,75.93 FPC1.4 FPC1.5 7.35,75.43 7.7,75.09 7.7,74.55 7.08,73.93 5.62,73.93 5.45,73.76 4.97,73.76 4.8,73.93 FPC1.8 ; C17.2 35.52,20.01 35.26,19.75 34.9,19.75 34.63,19.48 34.63,17.71 34.84,17.5 34.84,16.9 35.1,16.63 38.35,16.63 ; 14.99,79.81 14.99,79.89 v1(15.07,79.98) ; U14.- 6.69,13.77 v1(10.92,13.77) ; R4.1 14.3,80.76 14.53,80.76 15.24,80.05 ; 5.83,90.6 v1(5.59,90.6) ; 5.83,90.6 5.83,86.51 CARD1.13 ; U18.4 32.38,62.31 v1(32.38,59.49) 31.36,58.46 R18.2 ; 75.27,95.43 75.78,95.94 76.2,95.94 76.58,96.31 U25.21 81.51,96.31 U25.11 84.69,97.06 R29.1 ; 75.27,95.43 75.27,94.41 C58.2 72.82,94.03 72.12,93.33 72.12,92.59 U13.77 ; U9.25 39.84,15.88 U9.5 39.84,18.8 C15.2 ; U9.25 v1(33.78,14.91) ; U9.25 38.86,16.14 38.37,16.63 38.35,16.63 ; U9.25 38.86,13.66 38.39,13.19 37.7,13.19 37.44,12.93 37.44,12.24 U9.16 U9.15 ; 87.75,87.87 83.75,91.87 U13.65 U13.64 85.12,92.59 85.12,93.33 85.21,93.42 R28.1 ; 87.75,87.87 U13.61 ; 87.75,87.87 87.75,86.78 87.72,86.75 ; NOREF#6.1 1.89,83.38 v1(1.91,83.36) ; U13.135 U13.132 ; U13.135 U13.134 ; U17.2 51.75,83.74 C36.1 v1(52.46,86.49) D1.1 53.9,86.92 C37.1 ; U13.77 U13.78 ; U7.17 97.41,46.79 U7.11 ; U7.17 98.91,47.04 U7.3 ; v1(12.45,79.68) R2.1 ; JP1.3 JP1.2 96.45,67.75 93.56,67.75 ; 17.02,23.8 17.02,28.65 R7.2 ; 17.02,23.8 14.5,23.8 U16.6 ; U7.4 U7.3 ; U7.3 U7.2 ; 51.21,92.98 50.48,92.25 ; 87.72,86.75 U13.60 ; 93.56,67.75 93.93,68.12 94.68,68.12 94.84,68.29 v1(94.84,68.91) 94.84,69.22 94.68,69.38 93.93,69.38 93.56,69.75 U13.43 ; 93.56,67.75 U13.41 92.44,67.75 91.9,67.22 91.9,65.47 U13.83 88.49,62.32 87.21,63.6 85.28,63.6 85.12,63.43 85.12,62.69 U13.37 84.75,60.23 C46.1 ; C35.2 87.12,18.21 87.66,18.76 88.73,18.76 88.9,18.59 88.9,16.05 U12.8 88.94,14.11 U12.25 89.53,12.75 v1(84.76,12.75) ; 38.35,16.63 37.89,17.09 U9.8 ; v1(50.8,49.2) 49.51,49.2 C44.1 ; U10.25 55.12,13.03 54.65,12.55 53.96,12.55 53.69,12.29 53.69,11.6 U10.16 U10.15 ; U10.25 v1(49.91,14.28) ; U10.25 56.09,15.25 U10.5 56.09,18.42 C21.2 ; U10.25 55.12,16.13 54.98,16 54.61,16 54.34,16.26 54.34,16.95 U10.8 54.14,17.84 53.92,18.06 53.92,20.12 53.76,20.28 52.74,20.28 52.19,19.74 C23.2 ; 45.78,26.48 v1(45.73,26.43) C13.2 ; C41.1 58.93,73.75 58.93,73.72 59.35,73.3 59.35,72.27 58.93,71.85 58.93,71.03 58.74,71.03 57.87,70.16 57.87,70.05 57.54,69.72 57.43,69.72 U19.1 v1(55.71,68) 55.26,67.55 54.66,67.55 54.5,67.39 54.5,66.79 54.31,66.6 C48.1 54.15,65.93 54.15,65.09 54.36,64.88 R13.2 ; FPC1.26 1.04,79.15 v1(0.89,79.3) ; v1(96.65,24.69) 96.61,24.65 C32.2 ; v1(69.08,34.24) U26.12 ; 60.83,25.54 61.07,25.78 v1(61.72,25.78) ; 16.51,80.44 15.75,81.2 R3.1 ; X2.4 21.62,64.27 X2.2 24.98,62.57 v1(25.15,62.41) 25.4,62.66 25.4,63.22 25.95,63.77 25.95,64.79 25.4,65.34 C55.1 ; U13.121 70.72,77.75 67.58,77.75 67.15,77.32 65.32,77.32 64.89,77.75 U13.10 ; v1(16.3,62.15) C56.2 ; v1(35.43,79.17) C52.1
  vias: v1(16.38,80.31) v1(30.4,46.1)
V1: length 7.7
  Top Layer w0.254: 38.48,5.23 39.19,5.94 39.19,12.04 U9.20
V2: length 6.9
  Top Layer w0.254: U10.20 55.44,11.4 55.24,11.2 55.24,10.51 55.13,10.4 55.13,5.23
V3: length 7
  Top Layer w0.254: U11.20 72.72,11.28 72.52,11.08 72.52,10.39 72.21,10.09 72.21,5.11
V4: length 5.9
  Top Layer w0.254: 90.3,5 90.3,10.2 U12.19 U12.20
3CTS: length 161.9
  Top Layer w0.254: v1(13.33,66.34) 13.61,66.62 13.82,66.62 13.94,66.75 U24.43 ; v1(67.82,52.25) 67.89,52.32 82.22,52.32 82.42,52.12 v1(84.58,52.12) ; v1(97.79,61.52) 99.57,63.3 99.57,80.22 99.52,80.26 99.52,90.39 90.43,99.48 80.92,99.48 80.58,99.14 v1(80.39,99.14) 80.39,99.04 80.34,98.99 80.34,98.15 U25.15 ; v1(32.13,47.04) 32.26,47.17 v1(35.94,47.17) ; 13.21,64.82 v1(11.68,66.34)
  Bottom Layer w0.254: v1(67.82,52.25) 57.09,52.25 49.85,45.01 38.1,45.01 v1(35.94,47.17) ; v1(11.68,66.34) v1(13.33,66.34) ; v1(32.13,47.04) 31.7,47.47 31.7,49.04 28.3,52.44 26.73,52.44 19.05,60.12 15.11,60.12 13.21,62.03 v1(13.21,64.82) ; v1(84.58,52.12) 93.14,60.68 93.28,60.68 93.62,61.02 93.62,61.16 93.98,61.52 v1(97.79,61.52)
3DCD: length 123.8
  Top Layer w0.254: v1(10.41,66.6) 10.54,66.6 v1(12.32,64.82) ; U25.18 78.68,98.15 78.68,98.61 78.42,98.86 73.8,98.86 73.16,98.22 v1(72.28,98.22) ; v1(9.91,64.69) 8.76,63.55 v1(5.02,63.55) ; v1(12.7,66.98) 13.67,66.98 14.25,67.56
  Bottom Layer w0.254: 72.28,98.22 72.06,98.45 72.06,99.45 71.93,99.57 13.86,99.57 12.81,98.52 12.81,90.39 4.8,82.39 4.8,82.2 2.87,80.27 2.87,79.95 2.04,79.12 2.04,66.4 4.64,63.81 4.76,63.81 v1(5.02,63.55) ; v1(10.41,66.6) 10.8,66.98 v1(12.7,66.98) ; v1(9.91,64.69) 10.03,64.82 v1(12.32,64.82)
3DTR: length 77.1
  Top Layer w0.254: U25.13 81.34,98.15 81.34,98.61 81.51,98.77 82.02,98.77 82.24,98.55 85.98,98.55 86.14,98.39 86.14,97.29 87.4,96.04 90.32,96.04 90.54,95.81 v1(92.64,95.81) ; v1(68.2,47.93) U20.23
  Bottom Layer w0.254: v1(92.64,95.81) 95.58,92.88 95.58,79.44 88.01,71.87 88.01,67.74 v1(68.2,47.93)
3RI: length 95.2
  Top Layer w0.254: U20.24 70.89,46.79 v1(67.82,46.79) ; v1(73,98.89) 73.33,99.22 78.57,99.22 79.03,98.75 79.03,98.75 79.18,98.61 79.18,98.15 U25.17
  Bottom Layer w0.254: v1(73,98.89) 73,98.63 74.61,97.01 75.49,97.01 75.83,97.36 76.31,97.36 77.25,96.42 78.47,96.42 78.67,96.62 93.87,96.62 95.96,94.53 95.96,79.32 88.37,71.72 88.37,67.27 67.88,46.79 v1(67.82,46.79)
3RTS: length 132.8
  Top Layer w0.254: U24.27 15.31,73.58 15.31,74.01 15.14,74.17 14.71,74.17 14.48,74.41 v1(14.48,75.23) 12.24,77.48 12.24,77.86 11.89,78.2 11.51,78.2 10.16,79.55 v1(9.91,79.55) ; v1(91.98,92.92) 91.98,93.94 93.29,95.25 93.29,95.99 90.15,99.13 81.36,99.13 80.99,98.75 80.99,98.75 80.84,98.61 80.84,98.15 U25.14
  Bottom Layer w0.254: v1(9.91,79.55) 9.91,86.48 13.42,89.99 13.42,97.29 14.1,97.97 29.84,97.97 33.53,94.28 52.2,94.28 53.34,95.43 65.22,95.43 65.99,94.65 65.99,93.83 72.01,87.81 86.87,87.81 v1(91.98,92.92)
BCLK: length 152.7
  Top Layer w0.254: v1(51.56,50.09) 52.96,48.69 v1(55.12,48.69) ; v1(30.73,71.08) 31.56,71.08 33.43,72.95 33.91,72.95 34.8,73.84 v1(35.18,73.84) 36.19,74.85 v1(40.39,74.85) ; U24.11 21.97,71.56 v1(22.22,71.81) ; v1(61.21,48.69) 62.23,48.69 64.44,50.9 66.28,50.9 67.23,51.85 67.23,52.49 68.33,53.59 83.94,53.59 85.17,52.36 85.17,52.3 v1(85.72,51.74) ; v1(40.13,54.15) 39.5,53.52 v1(39.5,51.99) ; NOREF#3.1 1.1,84.81 1.78,84.81 3.09,83.5 v1(10.92,83.5) ; U7.16 98.41,44.75
  Bottom Layer w0.254: v1(40.13,54.15) 39.68,54.61 39.68,57.05 38.76,57.96 38.76,73.23 v1(40.39,74.85) ; v1(10.92,83.5) 11.32,83.11 27.31,83.11 35.18,75.23 v1(35.18,73.84) ; v1(85.72,51.74) 91.43,51.74 v1(98.39,44.78) ; v1(30.73,71.08) 30.23,71.58 22.45,71.58 v1(22.22,71.81) ; v1(39.5,51.99) 41.4,50.09 v1(51.56,50.09) ; v1(61.21,48.69) v1(55.12,48.69)
CAMPCLK: length 13.9
  Top Layer w0.254: v1(5.33,66.6) 5.03,66.91 4.44,66.91 4.41,66.93 FPC1.22 ; v1(15.11,65.46) 15.11,65.5 15.7,66.09 15.7,66.3 15.7,66.3 15.7,66.6
  Bottom Layer w0.254: v1(15.11,65.46) 14.81,65.76 14.81,65.83 14.47,66.17 13.98,66.17 13.58,65.76 7.31,65.76 6.48,66.6 v1(5.33,66.6)
CAMPDWN: length 34.9
  Top Layer w0.254: U24.8 21.77,70.36 v1(22.22,69.9) ; FPC1.11 7.28,72.43 v1(9.53,74.67) ; v1(26.42,73.38) 26.92,72.87 26.92,70.28 v1(26.29,69.65)
  Bottom Layer w0.254: v1(26.29,69.65) 26.2,69.74 22.39,69.74 v1(22.22,69.9) ; v1(9.53,74.67) 9.81,74.67 10.03,74.44 20.73,74.44 21.53,75.24 24.55,75.24 v1(26.42,73.38)
CAMXCLK: length 22.2
  Top Layer w0.254: v1(14.22,65.58) 14.29,65.58 14.84,66.14 15.25,66.14 15.35,66.24 15.35,66.73 U24.44 ; FPC1.10 3.47,72.86 3.02,72.86 1.02,70.85 1.02,68.5 3.02,66.5 3.47,66.5 FPC1.23 3.61,66.36 4.05,66.36 4.45,65.96 v1(6.1,65.96)
  Bottom Layer w0.254: v1(6.1,65.96) 6.66,65.4 13.72,65.4 13.9,65.58 v1(14.22,65.58)
CARDDETECT: length 94.5
  Top Layer w0.254: U20.5 72.68,46.66 72.11,46.08 66.11,46.08 v1(65.79,46.41) ; v1(62.36,46.41) 52.2,46.41 49.28,43.48 43.94,43.48 v1(39.24,48.18) ; v1(22.22,84.51) 20.46,84.51 CARD1.9
  Bottom Layer w0.254: v1(65.79,46.41) v1(62.36,46.41) ; v1(39.24,48.18) 35.76,51.67 35.76,56.37 36.81,57.42 36.81,74.37 26.67,84.51 v1(22.22,84.51)
COM1: length 15.7
  Top Layer w0.254: SW2.1 87.55,47.93 U20.6
CTS: length 3.1
  Top Layer w0.254: U13.67 81.38,92.59 81.38,93.33 81.21,93.5 80.72,93.5 80.34,93.87 80.34,94.36 80.26,94.44
D0: length 21.3
  Top Layer w0.254: 18.54,66.86 18.54,64.31 v1(18.8,64.06) ; v1(11.94,70.39) 11.72,70.6 11.63,70.6 11.42,70.81 7.03,70.81 6.59,71.25 5.48,71.25 5.16,70.93 FPC1.14
  Bottom Layer w0.254: v1(11.94,70.39) 12.1,70.39 18.43,64.06 v1(18.8,64.06)
D1: length 11.5
  Top Layer w0.254: v1(6.1,70.56) 5.3,70.56 5.19,70.46 3.57,70.46 FPC1.15 ; v1(12.45,69.09) 12.67,68.86 13.07,68.86 13.17,68.75 14.25,68.75
  Bottom Layer w0.254: v1(12.45,69.09) 11.89,69.65 10.92,69.65 10.08,70.48 6.17,70.48 v1(6.1,70.56)
D2: length 11.4
  Top Layer w0.254: 14.25,68.36 14.22,68.38 13.04,68.38 12.92,68.5 v1(11.56,68.5) ; FPC1.16 3.56,69.9 5.4,69.9 5.47,69.98 5.96,69.98 6.03,69.9 v1(6.67,69.9)
  Bottom Layer w0.254: v1(6.67,69.9) 6.92,69.9 6.93,69.92 7.42,69.92 7.43,69.9 10.16,69.9 v1(11.56,68.5)
D3: length 11.5
  Top Layer w0.254: v1(12.7,67.74) 13.33,67.74 13.53,67.93 14.22,67.93 14.25,67.95 ; v1(5.72,69.39) 5.64,69.47 4.71,69.47 4.67,69.43 FPC1.17
  Bottom Layer w0.254: v1(5.72,69.39) 6.29,69.39 7.76,67.92 12.52,67.92 v1(12.7,67.74)
D4: length 12.2
  Top Layer w0.254: 14.25,69.16 14.22,69.13 13.34,69.13 12.8,69.67 12.2,69.67 12.09,69.55 11.43,69.55 11.18,69.81 v1(11.18,70.23) 8.07,70.23 v1(7.17,69.33) 6.65,68.81 5.47,68.81 5.35,68.93 FPC1.18
D5: length 31.9
  Top Layer w0.254: v1(6.57,68.22) 5.27,68.22 5.07,68.43 FPC1.19 ; U24.5 22.22,69.16
  Bottom Layer w0.254: v1(22.56,69.16) 22.39,69.32 21.98,69.32 21.27,70.03 21.27,72.13 20.03,73.37 7.25,73.37 6.99,73.64 4.78,73.64 4.6,73.46 4.6,69.68 6.06,68.22 v1(6.57,68.22)
D6: length 17.3
  Top Layer w0.254: 16.91,66.72 16.91,66.01 16.97,65.94 16.97,65.16 16.91,65.09 16.91,64.99 16.02,64.11 ; 16.02,64.11 15.98,64.14 v1(15.89,64.14) 15.92,64.11 ; 16.02,64.11 15.92,64.11 ; 15.92,64.11 11.51,64.11 v1(9.02,66.6) ; FPC1.20 4.74,67.93 v1(4.83,67.84)
  Bottom Layer w0.254: v1(9.02,66.6) 8.89,66.6 8.05,67.43 6.54,67.43 6.21,67.77 5.73,67.77 5.68,67.72 4.95,67.72 v1(4.83,67.84)
D7: length 15.9
  Top Layer w0.254: 16.55,66.7 16.55,65.86 16.62,65.79 16.62,65.31 16.28,64.97 15.51,64.97 v1(15.24,64.69) 15.06,64.87 13.98,64.87 11.67,67.18 v1(5.97,67.18) 5.25,67.18 5.18,67.26 4.58,67.26 4.48,67.36 3.6,67.36 FPC1.21
D+: length 33.5
  Top Layer w0.254: v1(61.59,74.6) 61.75,74.75 U13.13 ; USBC1.B6 v1(57.28,94.28) ; v1(59.82,82.98) v1(59.82,74.6) 59.77,74.55 58.42,74.55 58.04,74.18 57.91,74.18 57.83,74.09 U19.5 ; 54.16,90.56 54.21,90.6 v1(55.5,90.6) ; USBC1.A6 v1(58.03,91.1)
  Bottom Layer w0.254: v1(58.03,91.1) 58.03,88.57 58.9,87.7 58.9,83.9 v1(59.82,82.98) ; v1(58.03,91.1) 57.66,91.47 57.66,91.87 57.28,92.25 v1(57.28,94.28) ; v1(58.03,91.1) 56,91.1 v1(55.5,90.6) ; v1(59.82,74.6) v1(61.59,74.6)
D-: length 28.8
  Top Layer w0.254: U13.12 63.27,75.74 v1(61.72,75.74) ; USBC1.B7 57.78,92.76 USBC1.A7 57.03,90.36 v1(56.39,89.71) 55.03,88.36 54.16,88.36 ; U19.6 57.43,76.07 57.54,76.07 57.94,76.47 v1(59.23,76.47) 59.23,82.42 v1(58.55,83.11)
  Bottom Layer w0.254: v1(61.72,75.74) 61.16,76.3 60.84,76.3 60.67,76.47 v1(59.23,76.47) ; v1(58.55,83.11) 58.55,87.55 v1(56.39,89.71)
DATA: length 80.1
  Top Layer w0.254: v1(10.92,82.61) 3.48,82.61 2.11,83.98 1.12,83.98 NOREF#4.1 ; v1(30.1,57.33) 30.4,57.02 35.59,57.02 v1(35.89,57.33) ; v1(18.17,63.49) 18.15,63.52 18.15,66.71
  Bottom Layer w0.254: v1(18.17,63.49) 23.83,57.84 29.59,57.84 v1(30.1,57.33) ; v1(35.89,57.33) 36.45,57.89 36.45,71.67 33.1,75.03 33.1,76.81 27.29,82.61 v1(10.92,82.61)
DCD: length 2.2
  Top Layer w0.254: U13.70 78.76,92.23 78.76,94.44
DIN: length 121.9
  Top Layer w0.254: v1(36.7,77.01) 35.19,78.53 35.19,78.59 34.24,79.54 29.01,79.54 28.31,78.84 v1(27.81,78.84) ; v1(99.19,44.75) 99.19,46.27 U7.1 ; v1(67.6,48.41) 67.85,48.41 67.96,48.51 82.22,48.51 82.32,48.41 91.09,48.41 v1(91.44,48.06) ; U24.13 20.95,72.38 21.38,72.38 21.69,72.69 21.69,73.11 24.38,75.8 v1(30.73,75.8) ; v1(47.75,47.42) 47.88,47.55 48.12,47.55 48.16,47.51 59.14,47.51 59.69,48.06 64.01,48.06 v1(64.52,47.55)
  Bottom Layer w0.254: v1(36.7,77.01) 36.96,76.76 36.96,75.23 38.41,73.78 38.41,57.91 36.68,56.19 36.68,52.27 41.52,47.42 v1(47.75,47.42) ; v1(91.44,48.06) 95.88,43.61 98.04,43.61 v1(99.19,44.75) ; v1(30.73,75.8) 29.34,77.19 29.34,77.69 29,78.03 28.76,78.03 27.88,78.92 27.81,78.92 ; v1(64.52,47.55) 66.74,47.55 v1(67.6,48.41)
DIO2: length 36.6
  Top Layer w0.254: U24.31 14.1,71.98 12.59,71.98 12.33,72.24 11.55,72.24 11.5,72.19 10.8,72.19 v1(10.54,72.44) ; U18.3 v1(31.24,61.01) R9.1
  Bottom Layer w0.254: v1(31.24,61.01) 32.13,61.9 32.13,64.82 29.67,67.28 24.91,67.28 24.46,67.73 23.06,67.73 20.92,69.88 20.92,71.98 19.88,73.02 11.5,73.02 10.92,72.44 v1(10.54,72.44)
DIR1: length 70.7
  Top Layer w0.254: v1(35.94,10.47) 35.94,12.03 U9.14 ; U20.1 81.26,41.71 v1(82.93,41.71)
  Bottom Layer w0.254: v1(35.94,10.47) 35.31,11.1 35.31,21.51 38.99,25.2 65.79,25.2 82.3,41.71 v1(82.93,41.71)
DIR2: length 58.9
  Top Layer w0.254: U10.14 52.19,9.62 v1(52.14,9.58) ; U20.2 v1(83.69,42.85)
  Bottom Layer w0.254: v1(52.14,9.58) 50.75,10.97 50.75,19.18 56.34,24.76 66.81,24.76 83.51,41.47 83.51,41.95 82.88,42.58 82.88,42.67 83.06,42.85 v1(83.69,42.85)
DIR3: length 46.6
  Top Layer w0.254: v1(69.47,9.7) 69.47,9.71 U11.14 ; U20.3 v1(84.46,44.12)
  Bottom Layer w0.254: v1(84.46,44.12) 84.28,43.94 84.28,42.61 83.87,42.2 83.87,41.32 68.15,25.59 68.15,11.02 v1(69.47,9.7)
DIR4: length 44.4
  Top Layer w0.254: U12.14 87,10.25 v1(87,8.81) ; U20.4 v1(86.36,45.39)
  Bottom Layer w0.254: v1(87,8.81) 85.34,10.47 85.34,34.7 86.36,35.71 v1(86.36,45.39)
DTR: length 9.1
  Top Layer w0.15: 81.26,94.57 81.13,94.7 81.13,95.09 81,95.22 78.5,95.22 78.41,95.3 78.41,95.8 78.28,95.93 77.24,95.93 77.11,95.8 77.11,95.33 77.17,95.27 77.17,92.64 U13.72
FCLK: length 27.3
  Top Layer w0.254: v1(11.94,71.3) 12.1,71.13 14.22,71.13 14.25,71.16 ; U18.6 31.24,69.11 28.47,66.34 v1(27.05,66.34)
  Bottom Layer w0.254: v1(27.05,66.34) 24.19,66.34 23.52,67.02 22.77,67.02 20.21,69.58 20.21,71.69 19.68,72.21 12.85,72.21 v1(11.94,71.3)
FCS: length 33.1
  Top Layer w0.254: v1(10.8,71.56) 11.37,71.56 11.7,71.88 12.18,71.88 12.51,71.56 U24.32 ; U18.1 v1(28.7,60.96) 28.7,60.17 28.75,60.12
  Bottom Layer w0.254: v1(28.7,60.96) 27.74,61.92 27.74,66.75 27.56,66.93 24.76,66.93 24.31,67.38 22.92,67.38 20.56,69.73 20.56,71.84 19.83,72.57 11.81,72.57 v1(10.8,71.56)
FIO0: length 28.4
  Top Layer w0.254: v1(27.05,65.46) 27.18,65.58 28.98,65.58 31.84,68.44 31.84,68.94 32.38,69.49 U18.5 ; 14.25,70.75 13.02,70.75 v1(12.79,70.53)
  Bottom Layer w0.254: v1(27.05,65.46) 26.92,65.46 26.39,65.99 24.05,65.99 23.37,66.67 22.49,66.67 19.85,69.31 19.85,71.54 19.58,71.81 13.08,71.85 12.66,71.44 12.66,70.65 v1(12.79,70.53)
FIO1: length 24
  Top Layer w0.254: 14.25,70.36 13.82,70.36 13.8,70.33 13.67,70.33 13.51,70.17 13.51,70.04 13.45,69.99 v1(13.33,69.99) ; v1(29.97,60.76) U18.2
  Bottom Layer w0.254: v1(13.33,69.99) 13.33,69.66 18.35,64.64 19.04,64.64 19.38,64.3 19.38,64.06 23.19,60.25 29.46,60.25 v1(29.97,60.76)
GNSSA: length 4
  Top Layer w0.254: 70.1,96.06 69.75,95.7 U13.79
IO3: length 40.1
  Top Layer w0.254: v1(15.95,77.52) 14.99,78.49 v1(14.99,78.79) ; v1(30.42,78.6) 30.42,78.03 33.15,75.3 33.15,74.92 32.75,74.52 32.27,74.52 32.25,74.54 30.52,72.81 30.52,72.73 30.36,72.57 30.28,72.57 R10.1 U18.7 ; U24.30 14.1,72.38 12.69,72.38 11.65,73.42 v1(11.65,77.62)
  Bottom Layer w0.254: v1(14.99,78.79) 13.81,77.62 v1(11.65,77.62) ; v1(15.95,77.52) 17.86,79.43 29.59,79.43 v1(30.42,78.6)
LED1: length 28.5
  Top Layer w0.254: 70.76,41.58 79.21,41.58 79.79,41 84.51,41 85.72,42.21 87.85,42.21 88.01,42.05 88.26,42.05 88.26,42.57 88.42,42.74 91.93,42.74 93.31,41.35 93.31,39.12 93.48,38.95 93.7,38.95 93.76,38.89 LED2.2
LED2: length 25.6
  Top Layer w0.254: LED3.2 90.21,38 88.69,39.52 88.42,39.52 87.85,38.95 86.62,38.95 85.01,40.56 70.87,40.56 70.43,41 69.93,41 69.59,41.34 69.59,41.82 69.67,41.91 69.67,42.92 70.69,42.92 70.76,42.85
LED3: length 23.1
  Top Layer w0.254: LED4.2 86.78,38.11 84.71,40.18 74.7,40.18 74.67,40.21 70.72,40.21 70.29,40.64 69.78,40.64 69.23,41.19 69.23,41.97 69.32,42.05 69.32,43.07 69.33,43.09 69.33,43.09 69.67,43.43 70.07,43.43 70.76,44.12
LED4: length 22.8
  Top Layer w0.254: U20.25 70.76,45.14 v1(68.33,45.14) ; LED5.2 81.7,39.42 v1(71.12,39.42)
  Bottom Layer w0.254: v1(71.12,39.42) 71.12,42.34 v1(68.33,45.14)
LRCLK: length 119.8
  Top Layer w0.254: U24.12 21.46,71.95 24.61,75.1 v1(31.75,75.1) ; 63.75,47.07 48.48,47.07 v1(48.29,46.88) ; v1(92.2,48.31) 90.68,49.83 69.71,49.83 68.86,48.99 67.35,48.99 67.01,48.65 67.01,47.14 v1(66.85,46.97) ; v1(29.08,78.79) 29.78,78.79 30.17,79.18 30.66,79.18 31.05,78.79 33.78,78.79 v1(36.32,76.25) ; U7.14 97.41,44.5 v1(97.41,44.5)
  Bottom Layer w0.254: v1(31.75,75.1) 31.75,76.12 v1(29.08,78.79) ; v1(63.75,47.12) 63.91,46.97 64.76,46.97 64.88,47.09 66.8,47.09 ; v1(97.41,44.5) 93.6,48.31 v1(92.2,48.31) ; v1(36.32,76.25) 36.32,75.36 38.05,73.63 38.05,58.16 36.32,56.43 36.32,52.12 41.6,46.84 47.99,46.84 48.07,46.91 48.26,46.91
LTEA: length 2.2
  Top Layer w0.254: JP1.1 95.35,66.75 U13.82
NETLIGHT: length 53.2
  Top Layer w0.254: v1(93.04,61.27) 93.04,44.43 94.36,43.1 98.42,43.1 99.47,42.05 99.47,39.12 99.31,38.95 98.5,38.95 LED1.2 ; v1(96.39,77.78) 93.2,77.78 U13.51
  Bottom Layer w0.254: v1(96.39,77.78) 90.68,72.06 90.68,65.46 93.04,63.1 v1(93.04,61.27)
NS: length 6.4
  Top Layer w0.254: U7.10 96.07,47.39 95.75,47.39 95.02,48.11 95.02,51.26 95.38,51.62 P1.1
PS: length 11.5
  Top Layer w0.254: P1.2 95.38,54.73 96.66,53.45 96.66,52.39 95.38,51.11 95.38,48.58 U7.9
PWRKEY: length 60
  Top Layer w0.254: U13.3 63.28,84.76 R5.2 60.83,84.9 v1(60.83,86.03) ; v1(23.88,76.18) 23.4,76.18 22.36,75.14 22.28,75.14 21.71,74.56 21.68,74.56 v1(21.34,74.22) 21.34,73.16 U24.14 ; v1(54.74,80.19) 55.22,79.7 v1(58.65,79.7) ; v1(26.67,78.84) 34.37,86.54 v1(38.61,86.54)
  Bottom Layer w0.254: v1(23.88,76.18) 24.01,76.18 v1(26.67,78.84) ; v1(58.65,79.7) 61.16,79.7 61.42,79.96 61.42,80.95 60.83,81.53 v1(60.83,86.03) ; v1(38.61,86.54) 46.11,86.54 51.16,81.48 53.44,81.48 v1(54.74,80.19)
RESET: length 183.4
  Top Layer w0.254: v1(51.18,64.57) 51.18,63.04 v1(54.23,60) ; v1(59.94,37.64) R38.1 61.38,36.25 62.45,35.18 62.45,34.41 U26.3 ; R12.2 48.26,75.61 C40.2 48.48,74.35 v1(49.53,74.35) ; R12.2 49.82,77.19 49.82,78.13 50.15,78.46 51.1,78.46 56.39,83.75 U13.4 ; R12.2 47.97,75.62 47.26,76.33 46.23,76.33 45.51,75.62 35.69,75.62 33.38,73.31 31.84,73.31 v1(31.2,72.67) ; v1(9.4,75.43) 7.4,73.43 5.62,73.43 5.6,73.41 4.82,73.41 4.79,73.43 FPC1.9 ; v1(27.18,73.58) 27.31,73.46 27.31,69.58 26.86,69.14 26.61,69.14 26.53,69.06 26.05,69.06 25.97,69.14 25.82,69.14 25.82,68.97 25.66,68.81 25.46,68.81 23.88,67.23 R27.1 22.11,68.75 21.06,68.75 ; v1(64.52,59.23) 66.04,57.71 66.04,52.88 ; 66.04,52.88 v1(66.04,51.49) ; 66.04,52.88 67.44,54.28 U20.18 71.88,54.28 76.96,59.36 v1(82.17,59.36) ; 87.24,41.38 86.93,41.08 v1(85.52,41.08)
  Bottom Layer w0.254: v1(66.04,51.49) 59.94,45.38 v1(59.94,37.64) ; v1(82.17,59.36) 85.52,56.01 85.52,53.89 84,52.36 84,50.8 85.52,49.28 v1(85.52,41.08) ; v1(49.53,74.35) 49.53,66.22 v1(51.18,64.57) ; v1(9.4,75.43) 9.59,75.43 10.11,74.91 10.11,74.91 10.21,74.91 11.12,75.82 14.72,75.82 15.06,75.48 15.06,74.99 15.2,74.85 20.64,74.85 21.39,75.6 25.16,75.6 v1(27.18,73.58) 30.29,73.58 v1(31.2,72.67) ; v1(54.23,60) 61.98,60 62.03,60.04 62.03,60.36 62.37,60.71 63.04,60.71 v1(64.52,59.23)
RESET_EN: length 3.2
  Top Layer w0.254: C39.2 46.22,72.41 R11.2
RI: length 2.4
  Top Layer w0.254: U13.69 79.75,93.15 79.38,93.52 79.38,93.87 79.34,93.9 79.34,94.36 79.26,94.44
RTS: length 3.7
  Top Layer w0.254: U13.66 82.75,92.22 82.75,92.58 82.38,92.95 82.38,93.33 82.38,93.33 82.21,93.5 81.72,93.5 81.36,93.85 81.02,93.85 80.84,94.03 80.84,94.49 80.77,94.57 80.76,94.57
RXD: length 2.6
  Top Layer w0.254: 79.76,94.44 79.76,93.95 80.39,93.32 80.39,92.89 80.75,92.53 U13.68
SCL: length 234.2
  Top Layer w0.254: v1(1.52,80.31) 1.52,78.94 1.72,78.74 1.72,75.8 3.02,74.5 3.47,74.5 FPC1.7 5.21,74.43 ; U26.22 62.69,40.35 62.69,42.13 61.35,43.47 ; U13.55 96.05,81.75 96.52,82.22 v1(96.65,82.22) ; 82.93,55.55 87,51.49 87,51.23 86.82,51.05 68.85,51.05 61.35,43.56 61.35,43.47 ; 82.93,55.55 U20.12 ; 82.93,55.55 86.5,55.55 92.8,61.85 96.47,61.85 v1(97.41,62.79) ; v1(23.59,68.32) 23.63,68.36 R26.1 22.4,70.75 21.06,70.75 ; v1(42.29,41.2) 44.21,41.2 44.52,41.51 46.82,41.51 47.13,41.2 54.92,41.2 U8.16 55.54,41.31 58.05,41.31 60.21,43.47 61.35,43.47 ; U16.4 v1(21.59,25.2) ; v1(2.29,85.9) 0.9,85.9 NOREF#5.1 ; v1(23.62,58.98) v1(23.62,61.14) ; v1(35.56,58.22) 32.26,58.22 v1(31.88,57.84) ; v1(27.31,68.12) 27.26,68.12 25.66,66.52 24.56,66.52 v1(23.62,65.58)
  Bottom Layer w0.254: v1(31.88,57.84) 30.42,57.84 30.06,58.19 24.41,58.19 v1(23.62,58.98) ; v1(21.59,25.2) 27.62,25.2 28.21,24.61 28.69,24.61 29.03,24.96 29.03,25.44 28.8,25.67 28.8,27.71 v1(42.29,41.2) 35.43,41.2 35.43,46.85 35.36,46.93 35.36,47.41 35.31,47.46 35.31,57.57 35.56,57.82 v1(35.56,58.22) ; v1(23.59,68.32) 25.34,68.32 25.78,68.76 26.57,68.76 26.59,68.78 ; 26.59,68.78 26.64,68.78 v1(27.31,68.12) ; 26.59,68.78 26.87,69.06 26.87,70.84 26.49,71.22 21.98,71.22 21.64,71.56 21.64,72.39 20.31,73.73 7.4,73.73 6.79,74.34 v1(5.21,74.34) ; v1(1.52,80.31) 4.09,82.88 4.09,84.1 v1(2.29,85.9) ; v1(23.62,61.14) v1(23.62,65.58) ; v1(96.65,82.22) 96.65,78.92 98.93,76.63 98.93,64.31 v1(97.41,62.79)
SCL1: length 37.6
  Top Layer w0.254: U26.5 63.88,34.2 63.88,32.94 62.48,31.54 62.48,29.51 ; v1(36.59,19.11) 36.59,17.79 U9.10 ; R31.1 61.48,28.5 v1(60.58,28.5) 54.74,28.5 52.2,25.96 v1(52.2,24.44)
  Bottom Layer w0.254: v1(36.59,19.11) 41.51,24.03 51.17,24.03 51.57,24.44 v1(52.2,24.44)
SCL2: length 27.4
  Top Layer w0.254: U10.10 52.84,18.2 52.41,18.63 v1(52.41,18.72) ; v1(64.52,24.18) 63.47,25.22 63.47,26.43 R33.1 65.05,28.21 65.05,34.07 U26.7
  Bottom Layer w0.254: v1(64.52,24.18) 63.82,24.18 63.23,23.6 57.29,23.6 v1(52.41,18.72)
